# Altium project MAIN_BOARD.PrjPcb (part 2 of 3)

## Sheet USB.SchDoc
size C; SheetNumber: 5; SheetTotal: 9
Used 2 times, as channels USB0, USB1. Parts and nets are listed once, with the designators drawn on the sheet.
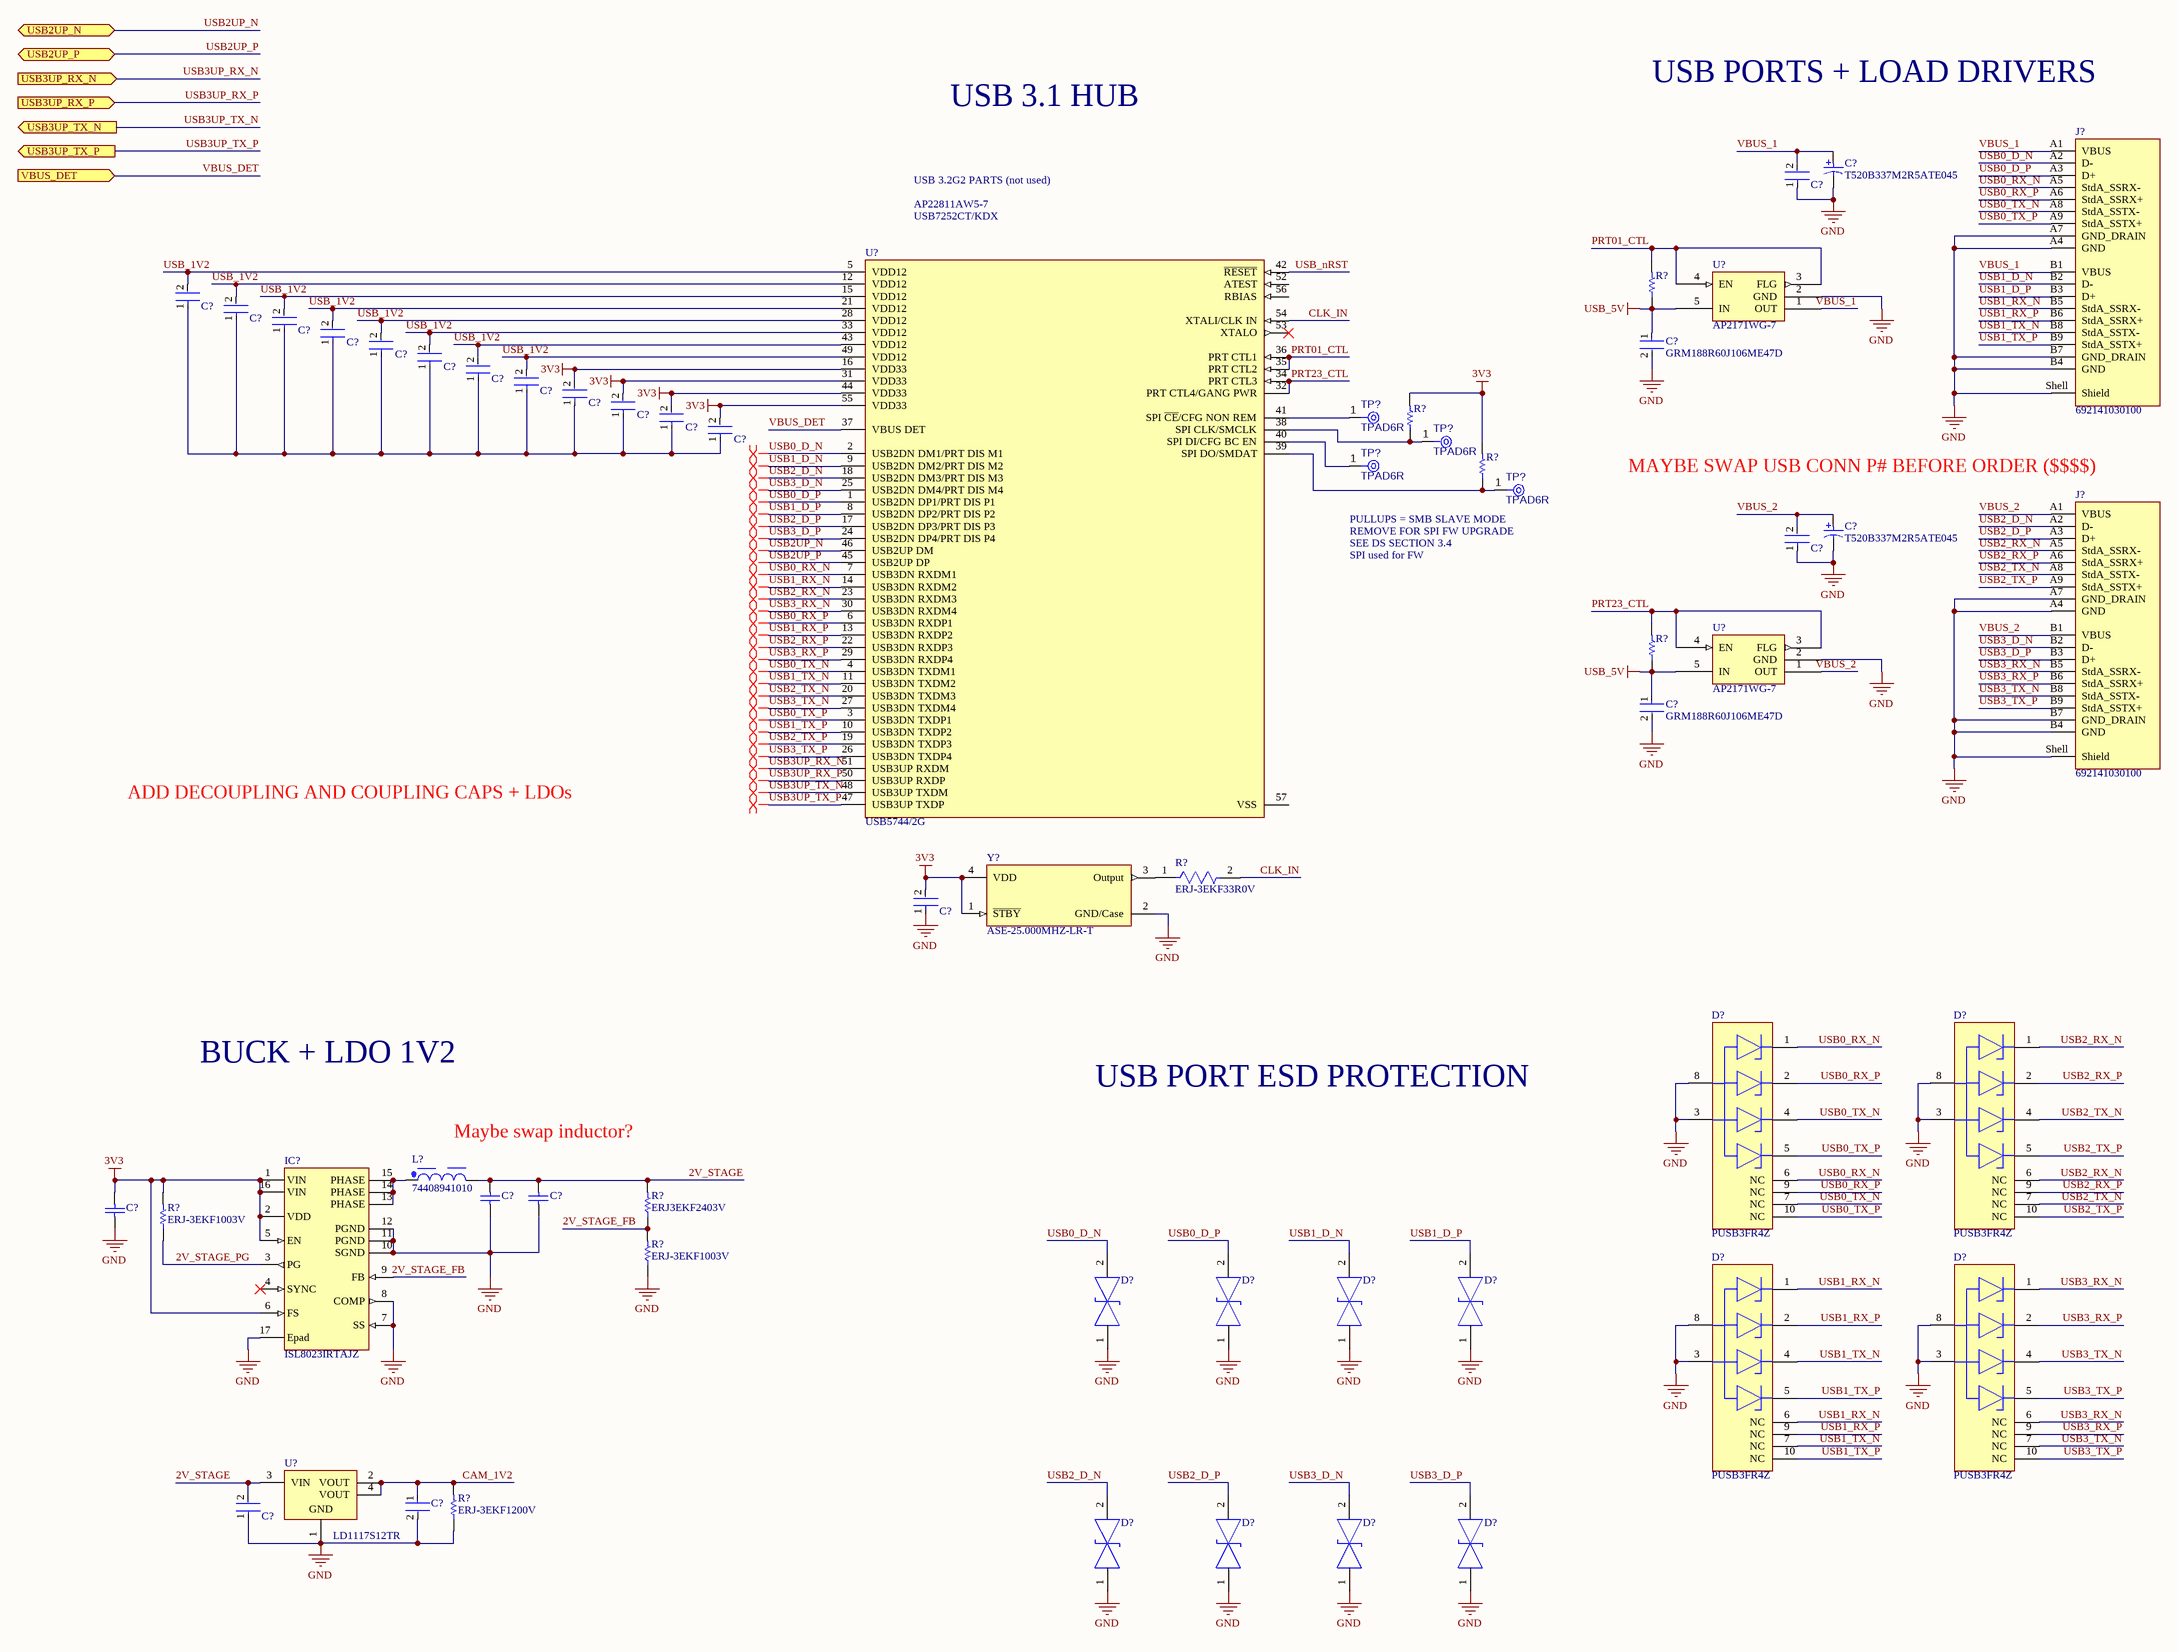
[diagram p7: USB.SchDoc]

### Parts
(Parts that share a designator on the sheet are numbered #1, #2 ... from top to bottom, then left to right.)
C?#1  T520B337M2R5ATE045  [KEMT-520-B-2_M]
C?#2  C1005X7R1H104K050BB  [FP-C1005-050-0_05-IPC_C]  (value not drawn)
C?#3  C1005X7R1H104K050BB  [FP-C1005-050-0_05-IPC_C]  (value not drawn)
C?#4  C1005X7R1H104K050BB  [FP-C1005-050-0_05-IPC_C]  (value not drawn)
C?#5  C1005X7R1H104K050BB  [FP-C1005-050-0_05-IPC_C]  (value not drawn)
C?#6  GRM188R60J106ME47D  [FP-GRM188-0_1-e0_2_0_55-IPC_A]
C?#7  C1005X7R1H104K050BB  [FP-C1005-050-0_05-IPC_C]  (value not drawn)
C?#8  C1005X7R1H104K050BB  [FP-C1005-050-0_05-IPC_C]  (value not drawn)
C?#9  C1005X7R1H104K050BB  [FP-C1005-050-0_05-IPC_C]  (value not drawn)
C?#10  C1005X7R1H104K050BB  [FP-C1005-050-0_05-IPC_C]  (value not drawn)
C?#11  C1005X7R1H104K050BB  [FP-C1005-050-0_05-IPC_C]  (value not drawn)
C?#12  C1005X7R1H104K050BB  [FP-C1005-050-0_05-IPC_C]  (value not drawn)
C?#13  C1005X7R1H104K050BB  [FP-C1005-050-0_05-IPC_C]  (value not drawn)
C?#14  C1005X7R1H104K050BB  [FP-C1005-050-0_05-IPC_C]  (value not drawn)
C?#15  C1005X7R1H104K050BB  [FP-C1005-050-0_05-IPC_C]  (value not drawn)
C?#16  T520B337M2R5ATE045  [KEMT-520-B-2_M]
C?#17  C1005X7R1H104K050BB  [FP-C1005-050-0_05-IPC_C]  (value not drawn)
C?#18  GRM188R60J106ME47D  [FP-GRM188-0_1-e0_2_0_55-IPC_A]
C?#19  C1005X7R1H104K050BB  [FP-C1005-050-0_05-IPC_C]  (value not drawn)
C?#20  C1608X5R0J226M080AC  [CAPC1608X100X20ML10]  (value not drawn)
C?#21  C1608X5R0J226M080AC  [CAPC1608X100X20ML10]  (value not drawn)
C?#22  C1608X5R0J226M080AC  [CAPC1608X100X20ML10]  (value not drawn)
C?#23  GRM188R60J106ME47D  [FP-GRM188-0_1-e0_2_0_55-IPC_A]  (value not drawn)
C?#24  C1005X7R1H104K050BB  [FP-C1005-050-0_05-IPC_C]  (value not drawn)
D?#1  PUSB3FR4Z  [FP-SOT1176-1-MFG]
D?#2  PUSB3FR4Z  [FP-SOT1176-1-MFG]
D?#3  PUSB3FR4Z  [FP-SOT1176-1-MFG]
D?#4  PUSB3FR4Z  [FP-SOT1176-1-MFG]
D?#5  ESD231B1W0201E6327XTSA1  [FP-SG-WLL-2-MFG]  (value not drawn)
D?#6  ESD231B1W0201E6327XTSA1  [FP-SG-WLL-2-MFG]  (value not drawn)
D?#7  ESD231B1W0201E6327XTSA1  [FP-SG-WLL-2-MFG]  (value not drawn)
D?#8  ESD231B1W0201E6327XTSA1  [FP-SG-WLL-2-MFG]  (value not drawn)
D?#9  ESD231B1W0201E6327XTSA1  [FP-SG-WLL-2-MFG]  (value not drawn)
D?#10  ESD231B1W0201E6327XTSA1  [FP-SG-WLL-2-MFG]  (value not drawn)
D?#11  ESD231B1W0201E6327XTSA1  [FP-SG-WLL-2-MFG]  (value not drawn)
D?#12  ESD231B1W0201E6327XTSA1  [FP-SG-WLL-2-MFG]  (value not drawn)
IC?  ISL8023IRTAJZ  [TQFN50P300X300X80_HS-17N]
J?#1  692141030100  [692141030100]
J?#2  692141030100  [692141030100]
L?  74408941010  [WE-SPC_4818]
R?#1  ERJ3EKF1002V  [RESC1609X55X30LL15T15]  (value not drawn)
R?#2  ERJ3EKF1002V  [RESC1609X55X30LL15T15]  (value not drawn)
R?#3  ERJ3EKF1002V  [RESC1609X55X30LL15T15]  (value not drawn)
R?#4  ERJ3EKF1002V  [RESC1609X55X30LL15T15]  (value not drawn)
R?#5  ERJ-3EKF33R0V  [FP-ERJ3EK-MFG]
R?#6  ERJ3EKF2403V  [RESC1608X55X30NL15T15]
R?#7  ERJ-3EKF1003V  [RESC1608X55X30ML15T15]
R?#8  ERJ-3EKF1003V  [RESC1608X55X30ML15T15]
R?#9  ERJ-3EKF1200V  [RESC1609X55X30ML15T15]
TP?#1  TPAD6R  [TP06R]  (no BOM)
TP?#2  TPAD6R  [TP06R]  (no BOM)
TP?#3  TPAD6R  [TP06R]  (no BOM)
TP?#4  TPAD6R  [TP06R]  (no BOM)
U?#1  USB5744/2G  [FP-USB5744-2G-MFG]
U?#2  AP2171WG-7  [SOT95P285X130-5N]
U?#3  AP2171WG-7  [SOT95P285X130-5N]
U?#4  LD1117S12TR  [SOT-223_M]
Y?  ASE-25.000MHZ-LR-T  [FP-ASE-MFG]

### Ports
USB2UP_N (bidir), USB2UP_P (bidir), USB3UP_RX_N (in), USB3UP_RX_P (in), USB3UP_TX_N (out), USB3UP_TX_P (out), VBUS_DET (in)

### Nets
3V3: C?#12.2 C?#13.2 C?#14.2 C?#15.2 C?#19.2 C?#22.2 IC?.1(VIN) IC?.2(VDD) IC?.5(EN) IC?.6(FS) IC?.16(VIN) R?#2.2 R?#3.2 R?#7.2 U?#1.16(VDD33) U?#1.31(VDD33) U?#1.44(VDD33) U?#1.55(VDD33) Y?.1(~{STBY}) Y?.4(VDD)
GND: C?#1.2 C?#2.1 C?#6.2 C?#16.2 C?#17.1 C?#18.2 C?#19.1 C?#20.1 C?#21.1 C?#22.1 C?#23.2 C?#24.1 D?#1.3(GND) D?#1.8(GND) D?#2.3(GND) D?#2.8(GND) D?#3.3(GND) D?#3.8(GND) D?#4.3(GND) D?#4.8(GND) D?#5.1 D?#6.1 D?#7.1 D?#8.1 D?#9.1 D?#10.1 D?#11.1 D?#12.1 IC?.7(SS) IC?.8(COMP) IC?.10(SGND) IC?.11(PGND) IC?.12(PGND) IC?.17(Epad) J?#1.A4(GND) J?#1.A7(GND_DRAIN) J?#1.B4(GND) J?#1.B7(GND_DRAIN) J?#1.Shell(Shield) J?#2.A4(GND) J?#2.A7(GND_DRAIN) J?#2.B4(GND) J?#2.B7(GND_DRAIN) J?#2.Shell(Shield) R?#8.1 R?#9.1 U?#2.2(GND) U?#3.2(GND) U?#4.1(GND) Y?.2(GND/Case)
USB_5V: C?#6.1 C?#18.1 R?#1.1 R?#4.1 U?#2.5(IN) U?#3.5(IN)
2V_STAGE: C?#20.2 C?#21.2 C?#24.2 L?.2 R?#6.2 U?#4.3(VIN)
2V_STAGE_FB: IC?.9(FB) R?#6.1 R?#8.2
2V_STAGE_PG: IC?.3(PG) R?#7.1
CAM_1V2: C?#23.1 R?#9.2 U?#4.2(VOUT) U?#4.4(VOUT)
CLK_IN: R?#5.2 U?#1.54(XTALI/CLK_IN)
PRT01_CTL: R?#1.2 U?#1.35(PRT_CTL2) U?#1.36(PRT_CTL1) U?#2.3(FLG) U?#2.4(EN)
PRT23_CTL: R?#4.2 U?#1.32(PRT_CTL4/GANG_PWR) U?#1.34(PRT_CTL3) U?#3.3(FLG) U?#3.4(EN)
USB0_D_N: D?#5.2 J?#1.A2(D-) U?#1.2(USB2DN_DM1/PRT_DIS_M1)
USB0_D_P: D?#6.2 J?#1.A3(D+) U?#1.1(USB2DN_DP1/PRT_DIS_P1)
USB0_RX_N: D?#1.1(CH1) D?#1.6(NC) J?#1.A5(StdA_SSRX-) U?#1.7(USB3DN_RXDM1)
USB0_RX_P: D?#1.2(CH2) D?#1.9(NC) J?#1.A6(StdA_SSRX+) U?#1.6(USB3DN_RXDP1)
USB0_TX_N: D?#1.4(CH3) D?#1.7(NC) J?#1.A8(StdA_SSTX-) U?#1.4(USB3DN_TXDM1)
USB0_TX_P: D?#1.5(CH4) D?#1.10(NC) J?#1.A9(StdA_SSTX+) U?#1.3(USB3DN_TXDP1)
USB1_D_N: D?#7.2 J?#1.B2(D-) U?#1.9(USB2DN_DM2/PRT_DIS_M2)
USB1_D_P: D?#8.2 J?#1.B3(D+) U?#1.8(USB2DN_DP2/PRT_DIS_P2)
USB1_RX_N: D?#3.1(CH1) D?#3.6(NC) J?#1.B5(StdA_SSRX-) U?#1.14(USB3DN_RXDM2)
USB1_RX_P: D?#3.2(CH2) D?#3.9(NC) J?#1.B6(StdA_SSRX+) U?#1.13(USB3DN_RXDP2)
USB1_TX_N: D?#3.4(CH3) D?#3.7(NC) J?#1.B8(StdA_SSTX-) U?#1.11(USB3DN_TXDM2)
USB1_TX_P: D?#3.5(CH4) D?#3.10(NC) J?#1.B9(StdA_SSTX+) U?#1.10(USB3DN_TXDP2)
USB2_D_N: D?#9.2 J?#2.A2(D-) U?#1.18(USB2DN_DM3/PRT_DIS_M3)
USB2_D_P: D?#10.2 J?#2.A3(D+) U?#1.17(USB2DN_DP3/PRT_DIS_P3)
USB2_RX_N: D?#2.1(CH1) D?#2.6(NC) J?#2.A5(StdA_SSRX-) U?#1.23(USB3DN_RXDM3)
USB2_RX_P: D?#2.2(CH2) D?#2.9(NC) J?#2.A6(StdA_SSRX+) U?#1.22(USB3DN_RXDP3)
USB2_TX_N: D?#2.4(CH3) D?#2.7(NC) J?#2.A8(StdA_SSTX-) U?#1.20(USB3DN_TXDM3)
USB2_TX_P: D?#2.5(CH4) D?#2.10(NC) J?#2.A9(StdA_SSTX+) U?#1.19(USB3DN_TXDP3)
USB2UP_N: U?#1.46(USB2UP_DM) ; port USB2UP_N
USB2UP_P: U?#1.45(USB2UP_DP) ; port USB2UP_P
USB3_D_N: D?#11.2 J?#2.B2(D-) U?#1.25(USB2DN_DM4/PRT_DIS_M4)
USB3_D_P: D?#12.2 J?#2.B3(D+) U?#1.24(USB2DN_DP4/PRT_DIS_P4)
USB3_RX_N: D?#4.1(CH1) D?#4.6(NC) J?#2.B5(StdA_SSRX-) U?#1.30(USB3DN_RXDM4)
USB3_RX_P: D?#4.2(CH2) D?#4.9(NC) J?#2.B6(StdA_SSRX+) U?#1.29(USB3DN_RXDP4)
USB3_TX_N: D?#4.4(CH3) D?#4.7(NC) J?#2.B8(StdA_SSTX-) U?#1.27(USB3DN_TXDM4)
USB3_TX_P: D?#4.5(CH4) D?#4.10(NC) J?#2.B9(StdA_SSTX+) U?#1.26(USB3DN_TXDP4)
USB3UP_RX_N: U?#1.51(USB3UP_RXDM) ; port USB3UP_RX_N
USB3UP_RX_P: U?#1.50(USB3UP_RXDP) ; port USB3UP_RX_P
USB3UP_TX_N: U?#1.48(USB3UP_TXDM) ; port USB3UP_TX_N
USB3UP_TX_P: U?#1.47(USB3UP_TXDP) ; port USB3UP_TX_P
USB_1V2: C?#3.2 C?#4.2 C?#5.2 C?#7.2 C?#8.2 C?#9.2 C?#10.2 C?#11.2 U?#1.5(VDD12) U?#1.12(VDD12) U?#1.15(VDD12) U?#1.21(VDD12) U?#1.28(VDD12) U?#1.33(VDD12) U?#1.43(VDD12) U?#1.49(VDD12)
USB_nRST: U?#1.42(~{RESET})
VBUS_1: C?#1.1 C?#2.2 J?#1.A1(VBUS) J?#1.B1(VBUS) U?#2.1(OUT)
VBUS_2: C?#16.1 C?#17.2 J?#2.A1(VBUS) J?#2.B1(VBUS) U?#3.1(OUT)
VBUS_DET: U?#1.37(VBUS_DET) ; port VBUS_DET
NetC?#3_1: C?#3.1 C?#4.1 C?#5.1 C?#7.1 C?#8.1 C?#9.1 C?#10.1 C?#11.1 C?#12.1 C?#13.1 C?#14.1 C?#15.1
NetIC?_13: IC?.13(PHASE) IC?.14(PHASE) IC?.15(PHASE) L?.1
NetR?#2_1: R?#2.1 TP?#2.1(TP) U?#1.38(SPI_CLK/SMCLK)
NetR?#3_1: R?#3.1 TP?#4.1(TP) U?#1.39(SPI_DO/SMDAT)
NetR?#5_1: R?#5.1 Y?.3(Output)
NetTP?#1_1: TP?#1.1(TP) U?#1.41(SPI_~{CE}/CFG_NON_REM)
NetTP?#3_1: TP?#3.1(TP) U?#1.40(SPI_DI/CFG_BC_EN)

Not connected (* = marked no-connect by the designer): IC? 4(SYNC)*; U?#1 52(ATEST) 53(XTALO)* 56(RBIAS) 57(VSS)

### Channels
USB0: designators C?=C?_USB0#19 C?=C?_USB0#1 C?=C?_USB0#16 C?=C?_USB0#2 C?=C?_USB0#17 C?=C?_USB0#6 C?=C?_USB0#18 C?=C?_USB0#15 C?=C?_USB0#14 C?=C?_USB0#13 C?=C?_USB0#12 C?=C?_USB0#11 C?=C?_USB0#10 C?=C?_USB0#9 C?=C?_USB0#8 C?=C?_USB0#7 C?=C?_USB0#5 C?=C?_USB0#4 C?=C?_USB0#3 C?=C?_USB0#24 C?=C?_USB0#23 C?=C?_USB0#22 C?=C?_USB0#21 C?=C?_USB0#20 D?=D?_USB0#3 D?=D?_USB0#4 D?=D?_USB0#2 D?=D?_USB0#1 D?=D?_USB0#5 D?=D?_USB0#6 D?=D?_USB0#7 D?=D?_USB0#8 D?=D?_USB0#9 D?=D?_USB0#10 D?=D?_USB0#11 D?=D?_USB0#12 IC?=IC?_USB0 J?=J?_USB0#1 J?=J?_USB0#2 L?=L?_USB0 R?=R?_USB0#5 R?=R?_USB0#2 R?=R?_USB0#3 R?=R?_USB0#1 R?=R?_USB0#4 R?=R?_USB0#9 R?=R?_USB0#7 R?=R?_USB0#6 R?=R?_USB0#8 TP?=TP?_USB0#1 TP?=TP?_USB0#2 TP?=TP?_USB0#3 TP?=TP?_USB0#4 U?=U?_USB0#1 U?=U?_USB0#2 U?=U?_USB0#3 U?=U?_USB0#4 Y?=Y?_USB0; ports USB2UP_N=USB2UP_N_USB0 USB2UP_P=USB2UP_P_USB0 USB3UP_RX_N=USB3UP_RX_N_USB0 USB3UP_RX_P=USB3UP_RX_P_USB0 USB3UP_TX_N=USB3UP_TX_N_USB0 USB3UP_TX_P=USB3UP_TX_P_USB0 VBUS_DET=VBUS_DET_USB0
USB1: designators C?=C?_USB1#19 C?=C?_USB1#1 C?=C?_USB1#16 C?=C?_USB1#2 C?=C?_USB1#17 C?=C?_USB1#6 C?=C?_USB1#18 C?=C?_USB1#15 C?=C?_USB1#14 C?=C?_USB1#13 C?=C?_USB1#12 C?=C?_USB1#11 C?=C?_USB1#10 C?=C?_USB1#9 C?=C?_USB1#8 C?=C?_USB1#7 C?=C?_USB1#5 C?=C?_USB1#4 C?=C?_USB1#3 C?=C?_USB1#24 C?=C?_USB1#23 C?=C?_USB1#22 C?=C?_USB1#21 C?=C?_USB1#20 D?=D?_USB1#3 D?=D?_USB1#4 D?=D?_USB1#2 D?=D?_USB1#1 D?=D?_USB1#5 D?=D?_USB1#6 D?=D?_USB1#7 D?=D?_USB1#8 D?=D?_USB1#9 D?=D?_USB1#10 D?=D?_USB1#11 D?=D?_USB1#12 IC?=IC?_USB1 J?=J?_USB1#1 J?=J?_USB1#2 L?=L?_USB1 R?=R?_USB1#5 R?=R?_USB1#2 R?=R?_USB1#3 R?=R?_USB1#1 R?=R?_USB1#4 R?=R?_USB1#9 R?=R?_USB1#7 R?=R?_USB1#6 R?=R?_USB1#8 TP?=TP?_USB1#1 TP?=TP?_USB1#2 TP?=TP?_USB1#3 TP?=TP?_USB1#4 U?=U?_USB1#1 U?=U?_USB1#2 U?=U?_USB1#3 U?=U?_USB1#4 Y?=Y?_USB1; ports USB2UP_N=USB2UP_N_USB1 USB2UP_P=USB2UP_P_USB1 USB3UP_RX_N=USB3UP_RX_N_USB1 USB3UP_RX_P=USB3UP_RX_P_USB1 USB3UP_TX_N=USB3UP_TX_N_USB1 USB3UP_TX_P=USB3UP_TX_P_USB1 VBUS_DET=VBUS_DET_USB1

### Layout directives
differential pair: USB0_D_N_USB0, USB0_D_P_USB0, USB0_RX_N_USB0, USB0_RX_P_USB0, USB0_TX_N_USB0, USB0_TX_P_USB0, USB1_D_N_USB0, USB1_D_P_USB0, USB1_RX_N_USB0, USB1_RX_P_USB0, USB1_TX_N_USB0, USB1_TX_P_USB0, USB2_D_N_USB0, USB2_D_P_USB0, USB2_RX_N_USB0, USB2_RX_P_USB0, USB2_TX_N_USB0, USB2_TX_P_USB0, USB2UP_N_USB0, USB2UP_P_USB0, USB3_D_N_USB0, USB3_D_P_USB0, USB3_RX_N_USB0, USB3_RX_P_USB0, USB3_TX_N_USB0, USB3_TX_P_USB0, USB3UP_RX_N_USB0, USB3UP_RX_P_USB0, USB3UP_TX_N_USB0, USB3UP_TX_P_USB0

### Notes on the sheet
- USB 3.1 HUB
- USB PORTS + LOAD DRIVERS
- AP22811AW5-7
- USB7252CT/KDX
- USB 3.2G2 PARTS (not used)
- MAYBE SWAP USB CONN P# BEFORE ORDER ($$$$)
- PULLUPS = SMB SLAVE MODE
- REMOVE FOR SPI FW UPGRADE
- SPI used for FW
- SEE DS SECTION 3.4
- ADD DECOUPLING AND COUPLING CAPS + LDOs
- BUCK + LDO 1V2
- Maybe swap inductor?
- USB PORT ESD PROTECTION

### Library data of the parts
C?#1 C?#16 = CMP-1664-00002-2: Tantalum Capacitor, 330 uF, +/- 20%, 2.5 V, -55 to 105 degC, 2-Pin Molded, RoHS, Tape and Reel; Capacitance: 330 uF; PartNumber: T520B337M2R5ATE045; DatasheetVersion: 07/2016; Radiation Hardening: No; ComponentLink2Description: Datasheet; PackageDescription: 2-Pin Surface Mount Device, Body 3.5 x 2.8 mm; Width: 2.8 mm; ComponentLink2URL: http://capacitoredge.kemet.com/capedge2/DataSheet?pn=T520B337M2R5ATE045; Case/Package: 1411; Length: 3.5 mm; Package Quantity: 2000; Max Operating Temperature: 105 degC; Mounting Technology: Surface Mount; Height: 2.1 mm; RoHSCompliant: True; ComponentLink1URL: http://www.kemet.com/; Mount: Surface Mount; Packaging: Tape and Reel; ComponentLink1Description: Manufacturer URL; Min Operating Temperature: -55 degC
C?#2-C?#5 C?#7-C?#15 C?#17 C?#19 C?#24 = CMP-2000-05393-2: as C?#1 on sheet CAMERA_INTERFACE; Voltage: 50V; Dielectric Material: Ceramic; Min Operating Temperature: -55°C; Depth: 0.5mm; Radiation Hardening: No; RoHS Compliant: Yes; Voltage Rating (DC): 50V; Lead Free: Lead Free; Resistor Type: Ceramic; Height: 0.5mm; Dielectric: X7R; Thickness: 0.022inch; Case/Package: 0402; Case Code (Metric): 1005; Termination: SMD/SMT; Capacitance: 100nF; Packaging: Tape and Reel; Max Operating Temperature: 125°C; Mount: Surface Mount; Package Quantity: 1; Width: 0.02inch; Weight: 2.3E-05oz; Voltage Rating: 50V; Tolerance: 10%; Construction: Flat; Case Code (Imperial): 0402; Length: 1mm; REACH SVHC: No SVHC; Series: C
C?#6 C?#18 C?#23 = CMP-2006-02792-2: as C?#21 on sheet CAMERA_INTERFACE; Packaging: Tape and Reel; Voltage Rating (DC): 6.3V; Width: 0.031inch; Termination: SMD/SMT; Dielectric: X5R; Package Quantity: 4000; Voltage Rating: 6.3V; Capacitance: 10uF; Case/Package: 0603; Min Operating Temperature: -55°C; Voltage: 6.3V; Length: 1.6mm; Thickness: 0.035inch; Lead Free: Lead Free; Depth: 0.8mm; Case Code (Imperial): 0603; Max Operating Temperature: 85°C; Material: Ceramic; Height: 0.8mm; Tolerance: 20%; Mount: Surface Mount; REACH SVHC: No SVHC; Radiation Hardening: No; Case Code (Metric): 1608
C?#20-C?#22 = CMP-2000-05440-1: Chip Capacitor, 22 uF, +/- 20%, 6.3 V, -55 to 85 degC, 1608 (0603 Metric), RoHS, Tape and Reel; PCN Part Number: MLCCPartNumberChange30/Nov/2012; Manufacturer: TDK; Temperature Coefficient: X5R; Product Training Modules: CSeriesGeneralApplicationsSEAT,CCV,andTVCLDesignToolsGuidetoReplacinganElectrolyticCapacitorwithanMLCC; Other Names: 445-8028-1; Capacitance: 22µF; Voltage - Rated: 6.3V; Design Resources: 20WNon-IsolatedBuckLEDDriverUsingPLLNK460KG; Online Catalog: CSeries,GeneralPurpose; Kits: 445-9003-KIT-ND-KITCAPCERHICAPMLCCSMD; Tolerance: ±20%; Series: C; Thickness (Max): 0.039"(1.00mm); Mounting Type: SurfaceMount,MLCC; Ratings: -; Datasheet Version: Mar-15; Package Reference: 603; Packaging: CutTape(CT); Features: -; Package / Case: 0603(1608Metric); Family: CeramicCapacitors; Lead Spacing: -; RoHS Information: RoHSCertificate-MLCC; Manufacturer URL: http://www.tdk.com/; Lead Style: -; Category: Capacitors; Applications: GeneralPurpose; Package Description: 2-Pin Surface Mount Device, Body 1.6 x 0.8 mm; Standard Package: 1; Datasheet URL: http://www.farnell.com/datasheets/1913358.pdf; Height - Seated (Max): -; Operating Temperature: -55degC~85degC; Size / Dimension: 0.063"Lx0.031"W(1.60mmx0.80mm)
D?#1-D?#4 = CMP-14432-000005-1: TVS DIODE 3.3VWM 3VC DFN2510A-10; RoHS Compliant: Yes
D?#5-D?#12 = CMP-32928-000003-1: TVS DIODE 5.5V 10V WLL-2-1; Manufacturer: Infineon; Number Of Channels: 1; Value: 3.5pF; Direction: Bidirectional; Peak Pulse Power: 132W; Peak Pulse Current: 12A; Temperature Range Low: -55°C; Automotive: No; Clamping Voltage: 10V; ComponentLink2Description: Datasheet; Lead Free: Yes; Octopart: https://octopart.com/esd231b1w0201e6327xtsa1-infineon-73507963; Mouser Description: 5.5V, 3.5pF, 0201, Bi-directional ESD/TVS Diode; Package: SG-WLL-2; Device Class L3: unset; Reverse Standoff Voltage: 5.5V; ComponentLink2URL: https://www.infineon.com/dgdl/Infineon-ESD231-B1-W0201-DS-v01_02-EN.pdf?fileId=5546d462503812bb0150854d4bac4c9d; Category: Diode; Device Class L2: TVS Diodes; Temperature Range High: +125°C; Manufacturer Part Number: ESD231B1W0201E6327XTSA1; Digikey Description: TVS DIODE 5.5V 10V WLL-2-1; Device Class L1: Circuit Protection; Temperature: -55°C to +125°C; Capacitance: 3.5pF; Footprint Url: https://www.infineon.com/cms/en/product/packages/SG-WLL/SG-WLL-2-1/; Height: 0.16mm; RoHS: TRUE
IC? = CMP-00572-88252977-1: ISL8023IRTAJZ Conv DC-DC Single Step Down 2.7V to 5.5V 16-Pin QFN EP; Output Current: 3A; NexarPartId: 88252977; Output Voltage: 5.5V
J?#1 J?#2 = CMP-1502-03222-3: NexarPartId: 19667819; Connector Type: USB; Contact Resistance: 50mΩ; USB Standard: USB 3.0; Insulation Resistance: 100MΩ; Number of Contacts: 18; Gender: Receptacle; Number of Ports: 2; Voltage Rating (AC): 30V; Current Rating: 1.8A; Min Operating Temperature: -40°C; Max Operating Temperature: 85°C; Lead Free: Lead Free; Features: Shielded; Width: 19.7mm; Length: 15.59mm; Flammability Rating: UL94 V-0; Contact Plating: Gold; RoHS: Compliant; Number of Pins: 18; Termination: Through Hole; Contact Material: Bronze, Gold, Nickel; Mount: Horizontal, Through Hole; Voltage Rating: 30V; Operating Supply Voltage: 30V; REACH SVHC: Unknown; Orientation: Right Angle; Color: Blue; Height: 16.335mm
L? = CMP-1401-00006-2: NexarPartId: 23392449; Current Rating: 3A; DC Resistance (DCR): 25mΩ; Inductance: 1µH; Core Material: Ferrite; Self Resonant Frequency: 100MHz; Inductance Tolerance: 20%; Number of Pins: 2; Length: 4.8mm; Width: 4.8mm; Min Operating Temperature: -40°C; Packaging: Tape & Reel (TR); RoHS: Compliant; Height: 1.8mm; Ambient Temperature Range High: 85°C; Max Operating Temperature: 125°C; Ambient Temperature Range Low: -40°C
R?#1-R?#4 = CMP-1012-00623-3: as R?#4 on sheet CAMERA_INTERFACE; Number of Pins: 2; Package Reference: 603; Depth: 0.8mm; Mount: SurfaceMount; Package Description: 2-Pin Surface Mount Device, Body 1.6 x 0.85 mm; Datasheet Version: 02/2017; Length: 1.6mm; Lead Free: LeadFree; Height: 0.45mm; Number of Terminations: 2; Max Power Dissipation: 100mW; Min Operating Temperature: -55degC; Datasheet URL: https://industrial.panasonic.com/cdbs/www-data/pdf/RDA0000/AOA0000C304.pdf; Termination: SMD/SMT; Case Code (Metric): 1608; Case Code (Imperial): 0603; Tolerance: 1%; Max Operating Temperature: 155degC; RoHSCompliant: true; Voltage Rating (DC): 75V; Radiation Hardening: No; Packaging: TapeandReel; Composition: ThickFilm; Mounting Technology: SurfaceMount; Manufacturer URL: http://www.panasonic.com/; Width: 0.031inch; REACH SVHC: NoSVHC; Contact Plating: Tin; Military Standard: Not; Package Quantity: 1
R?#5 = CMP-2000-00443-2: RES SMD 33 OHM 1% 1/10W 0603; Voltage Rating (DC): 75V; Power Rating: 100mW; Resistance: 33R; Temperature Coefficient: 100ppm/°C; Min Operating Temperature: -55°C; Packaging: Tape and Reel; Mount: Surface Mount; Lead Free: Lead Free; Voltage Rating: 75V; Features: Automotive AEC-Q200; Height: 0.022inch; Width: 0.031inch; Number of Pins: 2; Package Quantity: 1; Case Code (Metric): 1608; Max Power Dissipation: 100mW; Case Code (Imperial): 0603; Termination: SMD/SMT; Resistance Tolerance: 1%; Max Operating Temperature: 155°C; Tolerance: 1%; Length: 1.6mm; Case/Package: 0603; Military Standard: Not; RoHS Compliant: Yes; Series: ERJ; Size Code: 0603; Construction: Rectangular; Number of Terminations: 2; Radiation Hardening: No; Resistor Type: Thick Film; Contact Plating: Tin; Depth: 0.8mm; REACH SVHC: No SVHC
R?#6 = CMP-2000-00363-1: Manufacturer: Panasonic; Part Number: ERJ3EKF2403V
R?#7 R?#8 = CMP-2000-00182-1: Manufacturer: Panasonic; Part Number: ERJ-3EKF1003V
R?#9 = CMP-2000-00213-2: Chip Resistor, 120 Ohm, +/- 1%, 0.1 W, -55 to 155 degC, 0603 (1608 Metric), RoHS, Tape and Reel; Manufacturer: Panasonic; Power Rating: 100mW; Voltage Rating (DC): 75V; Resistance: 120Ohm; Temperature Coefficient: 100ppm/degreesC; Number of Terminations: 2; Military Standard: Not; Tolerance: 1%; Min Operating Temperature: -55degC; Packaging: TapeandReel; Lead Free: LeadFree; Max Operating Temperature: 155degC; Manufacturer URL: http://www.panasonic.com/; Case Code (Imperial): 0603; REACH SVHC: NoSVHC; Width: 0.031inch; Datasheet URL: https://industrial.panasonic.com/cdbs/www-data/pdf/RDA0000/AOA0000C283.pdf; RoHSCompliant: true; Max Power Dissipation: 100mW; Termination: SMD/SMT; Package Reference: 0603; Height: 0.022inch; Depth: 0.8mm; Package Description: 2-Pin Surface Mount Device, Body 1.6 x 0.85 mm; Contact Plating: Tin; Length: 1.6mm; Package URL: http://www.st.com/st-web-ui/static/active/en/resource/technical/document/datasheet/CD00001320.pdf; Radiation Hardening: No; Package Quantity: 1; Number of Pins: 2; Datasheet Version: 42095.0; Voltage Rating: 75V; Composition: ThickFilm; Case/Package: 0603; Mount: SurfaceMount; Case Code (Metric): 1608
TP?#1-TP?#4 = CMP-00028-00002-2: 0.6mm round; Pins: 1
U?#1 = CMP-06284-000017-1: IC HUB CTLR USB 56VQFN; Min Operating Temperature: 0°C; Packaging: Tray; Lead Free: Lead Free; Interface: USB; Max Operating Temperature: 70°C
U?#2 U?#3 = CMP-019-00057-1: IC PWR SW USB 1CH 1A SOT-25-5
U?#4 = CMP-0244-00318-1: Fixed Low Drop Positive Voltage Regulator, 1.2V, 4-Pin SOT-223, Tape and Reel; PackageDescription: 4-Pin SOT-223 Package, 6.5 x 3.5 mm Body, 2.3 mm Pitch, 7 mm Lead Span; PackageVersion: 2010; ComponentLink2Description: Datasheet; PackageReference: SOT-223; ComponentLink2URL: http://www.st.com/internet/com/TECHNICAL_RESOURCES/TECHNICAL_LITERATURE/DATASHEET/CD00000544.pdf; ComponentLink1Description: Manufacturer URL; DatasheetVersion: 1/11/2011; ComponentLink1URL: http://www.st.com
Y? = CMP-27762-000357-1: XTAL Oscillator 25MHz ±25ppm CMOS 3.3V 4-SMD 3.2mm x 2.5mm; Min Supply Voltage: 3.135V; Max Supply Current: 13mA; Max Supply Voltage: 3.465V; Load Capacitance: 15pF; Height: 0.047inch; Series: ASE; Frequency Stability: 25ppm; Mount: Surface Mount; Case/Package: SMD/SMT; Width: 0.098inch; Operating Frequency: 25 MHz; REACH SVHC: No SVHC; Package Quantity: 1000; Number of Pins: 4; Termination: SMD/SMT; Frequency: 25MHz; Max Operating Temperature: 85°C; Packaging: Tape and Reel; Min Operating Temperature: -40°C; Lead Free: Lead Free; Length: 0.126inch; Operating Supply Voltage: 3.3V

## Sheet ETHERNET.SchDoc
size A4; SheetNumber: 5; SheetTotal: 8
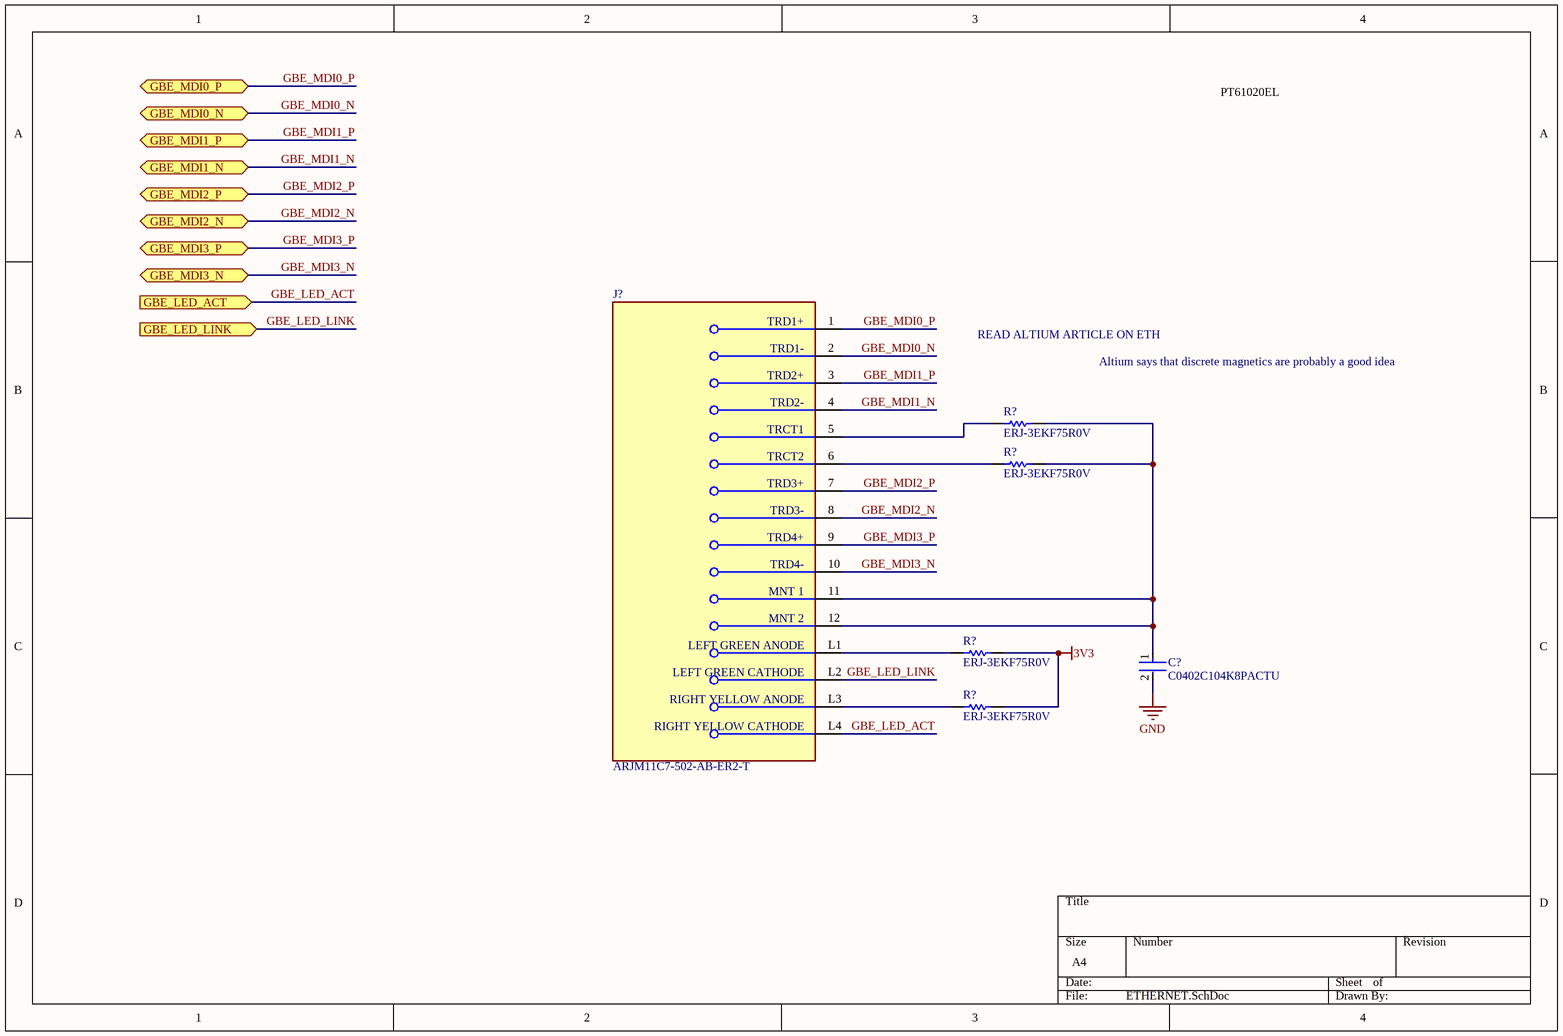
[diagram p8: ETHERNET.SchDoc]

### Parts
(Parts that share a designator on the sheet are numbered #1, #2 ... from top to bottom, then left to right.)
C?#1  C0402C104K8PACTU  [FP-C0402-BB-MFG]
J?#9  ARJM11C7-502-AB-ER2-T  [FP-ARJM11C7-502-AB-ER2-T-MFG]
R?#1  ERJ-3EKF75R0V  [RESC1608X55X30LL15T15]
R?#2  ERJ-3EKF75R0V  [RESC1608X55X30LL15T15]
R?#3  ERJ-3EKF75R0V  [RESC1608X55X30LL15T15]
R?#4  ERJ-3EKF75R0V  [RESC1608X55X30LL15T15]

### Ports
GBE_LED_ACT (in), GBE_LED_LINK (in), GBE_MDI0_N (bidir), GBE_MDI0_P (bidir), GBE_MDI1_N (bidir), GBE_MDI1_P (bidir), GBE_MDI2_N (bidir), GBE_MDI2_P (bidir), GBE_MDI3_N (bidir), GBE_MDI3_P (bidir)

### Nets
3V3: R?#3.1 R?#4.1
GND: C?#1.2
GBE_LED_ACT: J?#9.L4(RIGHT_YELLOW_CATHODE) ; port GBE_LED_ACT
GBE_LED_LINK: J?#9.L2(LEFT_GREEN_CATHODE) ; port GBE_LED_LINK
GBE_MDI0_N: J?#9.2(TRD1-) ; port GBE_MDI0_N
GBE_MDI0_P: J?#9.1(TRD1+) ; port GBE_MDI0_P
GBE_MDI1_N: J?#9.4(TRD2-) ; port GBE_MDI1_N
GBE_MDI1_P: J?#9.3(TRD2+) ; port GBE_MDI1_P
GBE_MDI2_N: J?#9.8(TRD3-) ; port GBE_MDI2_N
GBE_MDI2_P: J?#9.7(TRD3+) ; port GBE_MDI2_P
GBE_MDI3_N: J?#9.10(TRD4-) ; port GBE_MDI3_N
GBE_MDI3_P: J?#9.9(TRD4+) ; port GBE_MDI3_P
NetC?#1_1: C?#1.1 J?#9.11(MNT_1) J?#9.12(MNT_2) R?#1.1 R?#2.1
NetJ?#9_5: J?#9.5(TRCT1) R?#1.2
NetJ?#9_6: J?#9.6(TRCT2) R?#2.2
NetJ?#9_L1: J?#9.L1(LEFT_GREEN_ANODE) R?#3.2
NetJ?#9_L3: J?#9.L3(RIGHT_YELLOW_ANODE) R?#4.2

### Notes on the sheet
- PT61020EL
- READ ALTIUM ARTICLE ON ETH
- Altium says that discrete magnetics are probably a good idea

### Library data of the parts
C?#1 = CMP-2008-02046-2: CAP CER 0.1UF 10V X5R 0402; Manufacturer: Kemet; Material: Ceramic; Capacitance: 0.10 μF; Temperature Coefficient: 15%; Tolerance: 0.1; Value: 0.10 μF; Package: C0402-BB; Temperature: -55°C to +125°C; ComponentLink2Description: Datasheet; Temperature Characteristic: X5R; Device Class L1: Passive Components; Height: 0.55mm; Lead Free: Yes; ComponentLink2URL: https://content.kemet.com/datasheets/KEM_C1002_X7R_SMD.pdf; Device Class L2: Capacitors; Temperature Range Low: -55°C; Temperature Range High: +125°C; RoHS: TRUE; Octopart: https://octopart.com/c0402c104k8pactu-kemet-140039; Automotive: No; Mouser Description: Capacitor 100 nF 10 VDC 0402; Category: Cap; Voltage Rating: 10 V; Digikey Description: CAP CER 0.1UF 10V X5R 0402; Ipc Land Pattern Name: CAPC10050X50; Device Class L3: Ceramic Capacitors; Manufacturer Part Number: C0402C104K8PACTU
J?#9 = CMP-27893-000001-1: RJ45 JACK W/MAG 1X1 1000BASE-T; Manufacturer: Abracon; Conn Gender: Female; Is Female: yes; Shielding: true; Pitch: 1.27mm; Number Of Contacts: 10; Conn Orientation: Right Angle; RoHS: TRUE; Digikey Description: RJ45 JACK W/MAG 1X1 1000BASE-T; Temperature Range Low: -40°C; ComponentLink2Description: Datasheet; Category: Conn; Temperature Range High: +85°C; Package: 0; Device Class L1: Connectors; Manufacturer Part Number: ARJM11C7-502-AB-ER2-T; ComponentLink2URL: https://abracon.com/Magnetics/ARJM11.pdf; Automotive: No; Contact Material: Gold; Height: 15.8mm; Lead Free: Yes; Temperature: -40°C to +85°C; Device Class L2: Modular / Ethernet Connectors; Device Class L3: unset; Octopart: https://octopart.com/arjm11c7-502-ab-er2-t-abracon-86945316
R?#1-R?#4 = CMP-2000-00639-1: Manufacturer: Panasonic; Part Number: ERJ-3EKF75R0V

## Sheet REGULATORS.SchDoc
size A4; SheetNumber: 5; SheetTotal: 8
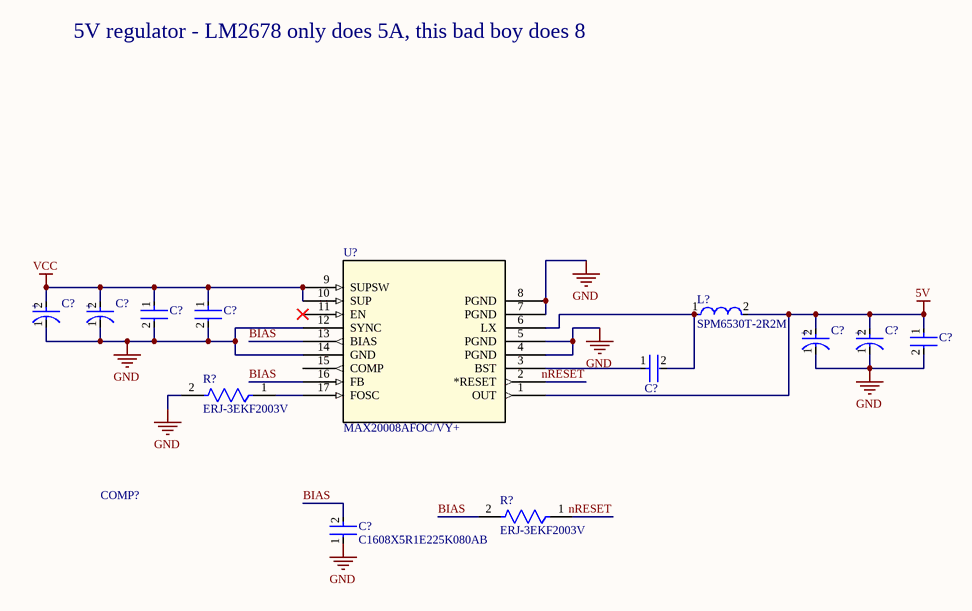
[diagram p9: REGULATORS.SchDoc]

### Parts
(Parts that share a designator on the sheet are numbered #1, #2 ... from top to bottom, then left to right.)
C?#2  100SXV6R8M  [FP-OS-CON-SMT-E7-MFG]  (value not drawn)
C?#3  100SXV6R8M  [FP-OS-CON-SMT-E7-MFG]  (value not drawn)
C?#4  C1206C475K4RACTU  [FP-C1206C475K4RACTU-MFG]  (value not drawn)
C?#5  C1005X7R1H104K050BB  [FP-C1005-050-0_05-IPC_C]  (value not drawn)
C?#6  EEHZA1H220P  [FP-EEH-D-MFG]  (value not drawn)
C?#7  EEHZA1H220P  [FP-EEH-D-MFG]  (value not drawn)
C?#8  C1206C475K4RACTU  [FP-C1206C475K4RACTU-MFG]  (value not drawn)
C?#9  C1005X7R1H104K050BB  [FP-C1005-050-0_05-IPC_C]  (value not drawn)
C?#10  C1608X5R1E225K080AB  [FP-C1608-080-0_1-MFG]
L?  SPM6530T-2R2M  [FP-SPM6530-MFG]
R?#5  ERJ-3EKF2003V  [FP-ERJ3EK-IPC_B]
R?#6  ERJ-3EKF2003V  [FP-ERJ3EK-IPC_B]
U?#1  MAX20008AFOC/VY+  [MAX20008AFOC_VY+-Footprint-1]

### Nets
5V: C?#6.2(A) C?#7.2(A) C?#8.1 L?.2 U?#1.1(OUT)
GND: C?#2.1(C) C?#3.1(C) C?#4.2 C?#5.2 C?#6.1(C) C?#7.1(C) C?#8.2 C?#10.1 R?#5.2 U?#1.4(PGND) U?#1.5(PGND) U?#1.7(PGND) U?#1.8(PGND) U?#1.12(SYNC) U?#1.14(GND)
VCC: C?#2.2(A) C?#3.2(A) C?#4.1 C?#5.1 U?#1.9(SUPSW) U?#1.10(SUP)
BIAS: C?#10.2 R?#6.2 U?#1.13(BIAS) U?#1.16(FB)
nRESET: R?#6.1 U?#1.2(*RESET)
NetC?#9_1: C?#9.1 U?#1.3(BST)
NetC?#9_2: C?#9.2 L?.1 U?#1.6(LX)
NetR?#5_1: R?#5.1 U?#1.17(FOSC)

Not connected (* = marked no-connect by the designer): U?#1 11(EN)* 15(COMP)

### Notes on the sheet
- 5V regulator - LM2678 only does 5A, this bad boy does 8
- COMP?
- (in symbol CMP-05428-001165-1) +
- (in symbol CMP-05428-001309-1) +

### Library data of the parts
C?#2 C?#3 = CMP-05428-001165-1: Conductive Polymer Aluminum Solid Capacitors (OS-CON) 6.8uF ±20% 100V RADIAL SMT 8x6.9mm; Life (Hours): 1000Hour; ESR (Equivalent Series Resistance): 60mR; Capacitance: 6.8uF; Case/Package: Radial; Max Operating Temperature: 125°C; Min Operating Temperature: -55°C; Tolerance: 20%; Mount: Surface Mount; Packaging: Cut Tape; Series: OS-CON™, SXV; Voltage Rating: 100V
C?#4 C?#8 = CMP-03020-034664-1: CAP CER 4.7UF 16V X7R 1206; Tolerance: 10%; Dielectric Material: Ceramic; Dissipation Factor: 5%; Voltage: 16V; Construction: Flat; Case Code (Imperial): 1206; REACH SVHC: No SVHC; Series: C; Length: 3.2mm; Max Operating Temperature: 125°C; Voltage Rating (DC): 16V; Mount: Surface Mount; Thickness: 0.071inch; Height: 1.2mm; Voltage Rating: 16V; Case/Package: 1206; Termination: SMD/SMT; Depth: 1.6mm; Dielectric: X7R; Width: 0.063inch; Min Operating Temperature: -55°C; Radiation Hardening: No; Case Code (Metric): 3216; RoHS Compliant: Yes; Capacitance: 4.7uF; Packaging: Tape and Reel; Package Quantity: 1; Number of Pins: 2
C?#5 C?#9 = CMP-2000-05393-2: as C?#1 on sheet CAMERA_INTERFACE; Voltage: 50V; Dielectric Material: Ceramic; Min Operating Temperature: -55°C; Depth: 0.5mm; Radiation Hardening: No; RoHS Compliant: Yes; Voltage Rating (DC): 50V; Lead Free: Lead Free; Resistor Type: Ceramic; Height: 0.5mm; Dielectric: X7R; Thickness: 0.022inch; Case/Package: 0402; Case Code (Metric): 1005; Termination: SMD/SMT; Capacitance: 100nF; Packaging: Tape and Reel; Max Operating Temperature: 125°C; Mount: Surface Mount; Package Quantity: 1; Width: 0.02inch; Weight: 2.3E-05oz; Voltage Rating: 50V; Tolerance: 10%; Construction: Flat; Case Code (Imperial): 0402; Length: 1mm; REACH SVHC: No SVHC; Series: C
C?#6 C?#7 = CMP-05428-001309-1: Aluminum Hybrid Polymer Capacitors 22uF 20% 50V Life 10000Hours AEC-Q200 RADIAL SMT; Ripple Current (AC): 1.1A; Lead Diameter: 0.65mm; Life (Hours): 5000Hour; ESR (Equivalent Series Resistance): 80mR; Leakage Current: 100uA; Technology: HYBRID; Height - Seated (Max): 0.24inch; Voltage Rating (DC): 50V; Min Operating Temperature: -55°C; Voltage Rating: 50V; Length: 5.8mm; Tolerance: 20%; Lead Pitch: 1.8mm; Voltage: 50V; Packaging: Tape and Reel; Mount: Surface Mount; REACH SVHC: No SVHC; Ripple Current: 1.1A; Case/Package: Radial; Package Quantity: 1000; Capacitance: 22uF; Series: ZA; Construction: Cylindrical; Diameter: 6.3mm; Height: 5.8mm; Max Operating Temperature: 105°C; Lead Free: Lead Free; RoHS Compliant: Yes; Termination: SMD/SMT; Material: Polymer; Radiation Hardening: No; Ratings: AEC-Q200
C?#10 = CMP-08246-003049-1: Multilayer Ceramic Capacitors 2.2μF ±10% 25V X5R SMD 0603; Capacitance: 2.2uF; Termination: SMD/SMT; Dielectric Material: Ceramic; REACH SVHC: No SVHC; Voltage Rating (DC): 25V; Voltage Rating: 25V; RoHS Compliant: Yes; Case Code (Imperial): 0603; Case/Package: 0603; Height: 0.8mm; Mount: Surface Mount; Min Operating Temperature: -55°C; Tolerance: 10%; Radiation Hardening: No; Dielectric: X5R; Depth: 0.8mm; Package Quantity: 4000; Length: 1.6mm; Weight: 7.1E-05oz; Resistor Type: Ceramic; Series: C; Thickness: 0.035inch; Width: 0.031inch; Case Code (Metric): 1608; Lead Free: Lead Free; Max Operating Temperature: 85°C; Packaging: Tape and Reel
L? = CMP-08253-000021-1: FIXED IND 2.2UH 8.2A 19 MOHM SMD; Manufacturer: TDK; Test Frequency: 100kHz; Shielding: true; Standoff Height: 0.15mm; Core Material: Metal; Saturation Current: 8.4A; Tolerance: 20%; Series Resistance: 19.1mΩ; Automotive: No; Octopart: https://octopart.com/spm6530t-2r2m-tdk-18903909; Mouser Description: Fixed Inductors 2.2uH 0.0173ohms 7.1x6.5x3mm; ComponentLink2URL: https://product.tdk.com/info/en/catalog/datasheets/inductor_commercial_power_spm6530_en.pdf; Height: 3mm; Device Class L2: Inductors; Package: SPM6530; Rms Current: 8.2A; ComponentLink2Description: Datasheet; RoHS: TRUE; Temperature Range Low: -40°C; Digikey Description: FIXED IND 2.2UH 8.2A 19 MOHM SMD; Device Class L1: Passive Components; Device Class L3: Fixed Inductors; Value: 2.2uH; Temperature Range High: +125°C; Inductance: 2.2uH; Temperature: -40°C to +125°C; Lead Free: Yes; Manufacturer Part Number: SPM6530T-2R2M; Composition: Wirewound; Category: Ind
R?#5 R?#6 = CMP-2000-00319-2: RES SMD 200K OHM 1% 1/10W 0603; Resistance: 200kR; Max Power Dissipation: 100mW; Working Voltage: 75V; Voltage Rating (DC): 50V; Temperature Coefficient: 100ppm/°C; Min Operating Temperature: -55°C; Resistor Type: Thick Film; Max Operating Temperature: 155°C; Packaging: Cut Tape; RoHS Compliant: Yes; Military Standard: Not; Termination: SMD/SMT; Tolerance: 1%; Case Code (Imperial): 0603; Depth: 0.8mm; Lead Free: Lead Free; Resistance Tolerance: 1%; Case Code (Metric): 1608; Mount: Surface Mount; Construction: Rectangular; REACH SVHC: No SVHC; Height: 0.022inch; Radiation Hardening: No; Package Quantity: 1; Voltage Rating: 75V; Contact Plating: Tin; Number of Terminations: 2; Length: 1.6mm; Series: ERJ; Technology: THICK FILM; Features: Automotive AEC-Q200; Case/Package: 0603; Power Rating: 100mW; Width: 0.031inch
U?#1 = CMP-019-00056-1: Converter DC to DC Step-Down 36V 220kHz to 2.2MHz 17-Pin FC2QFN

## Sheet HDMI.SchDoc
size C; SheetNumber: 6; SheetTotal: 9
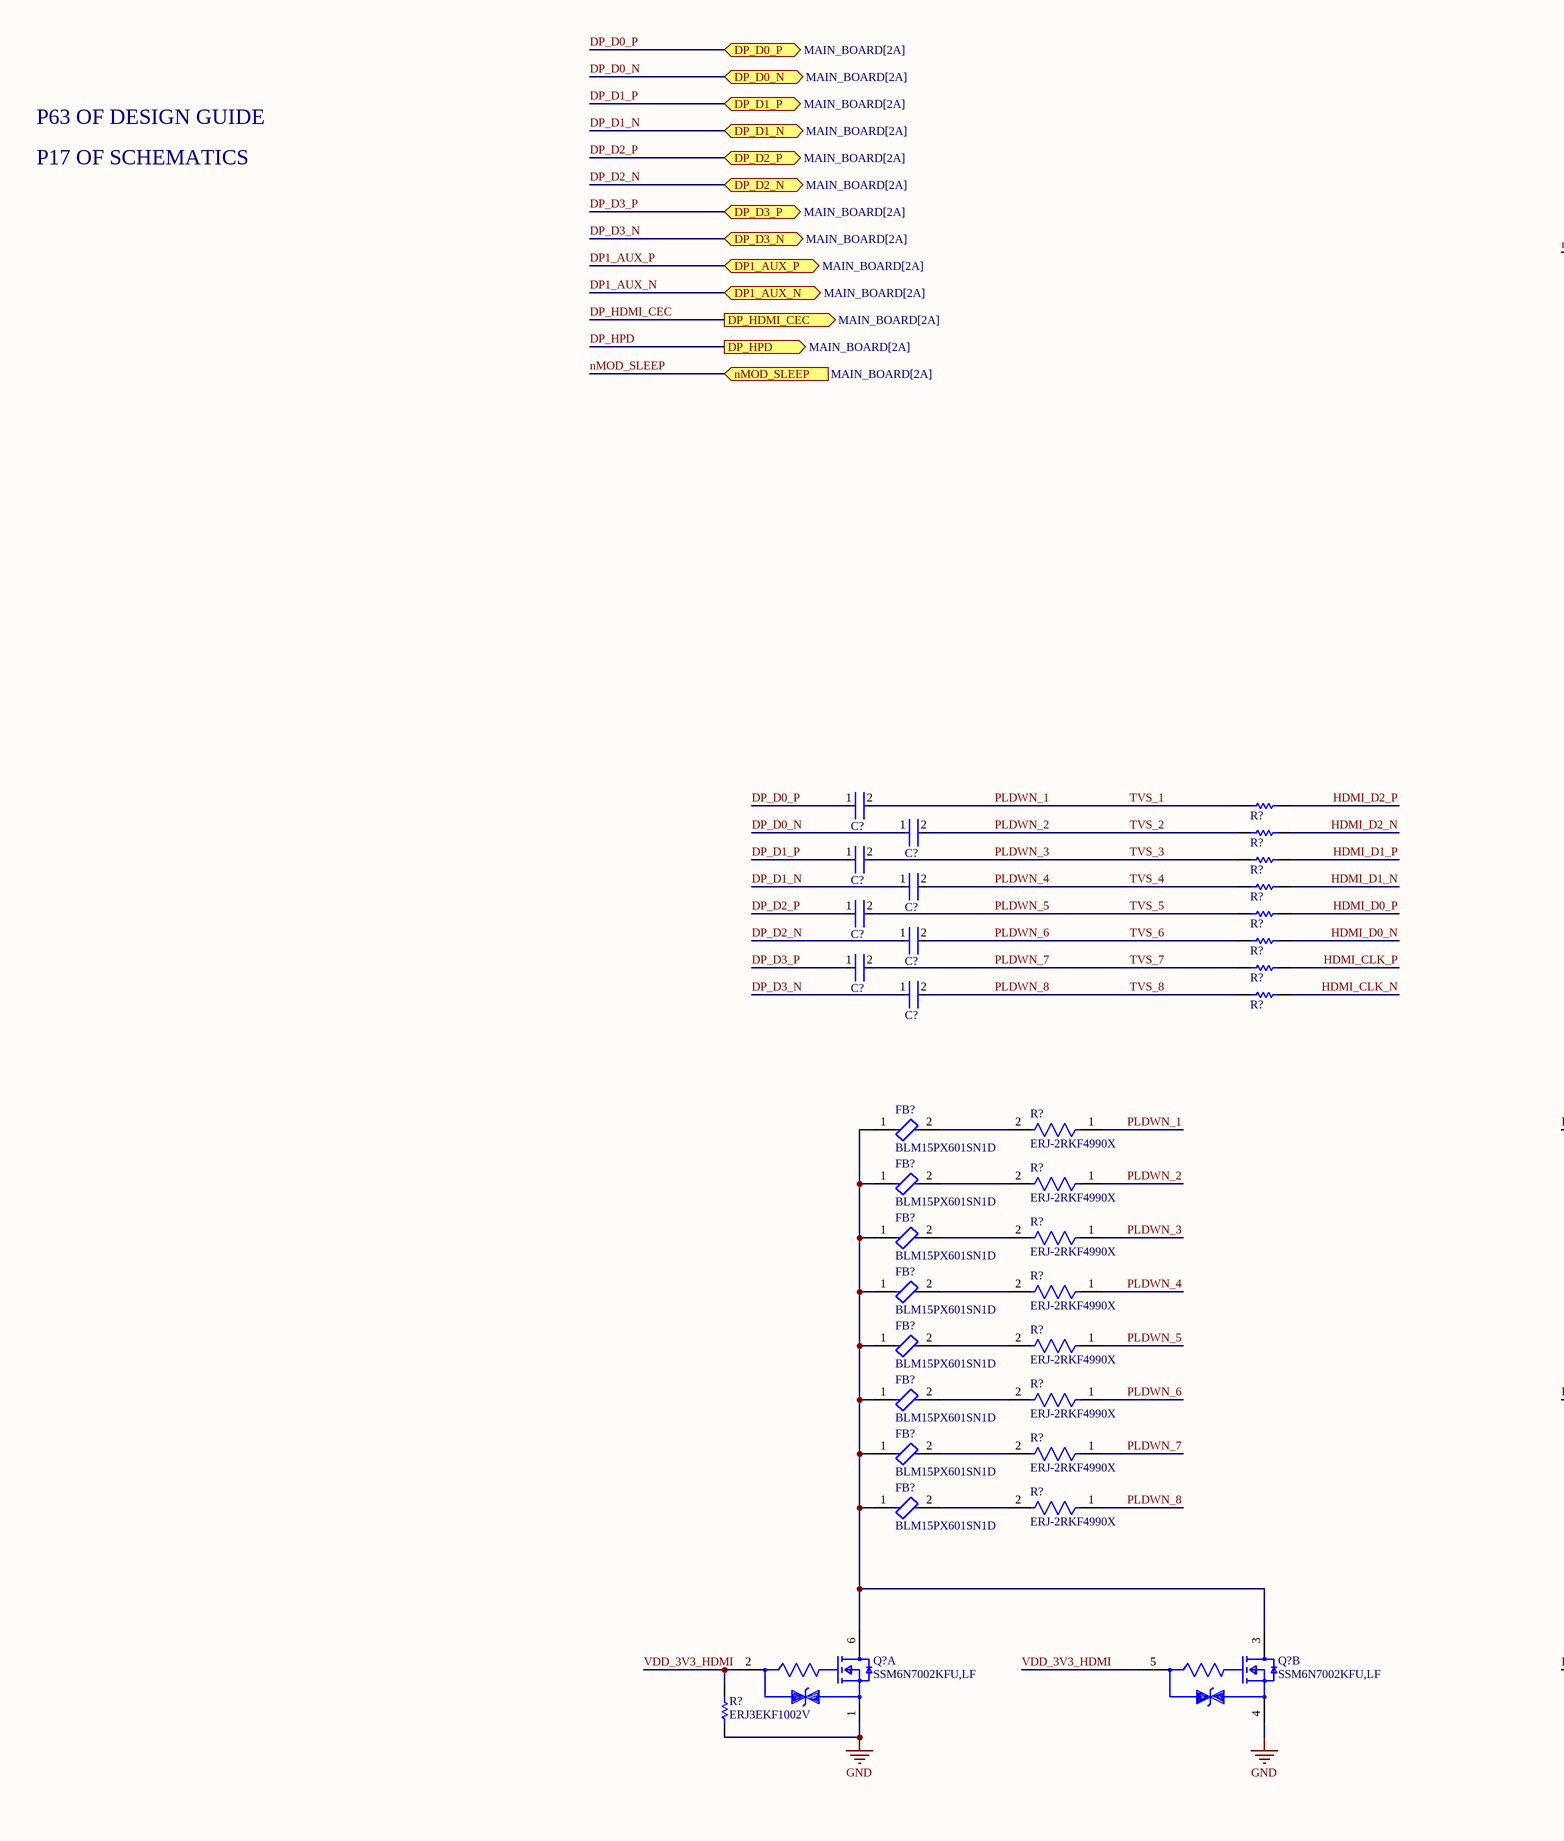
[diagram p10: HDMI.SchDoc, left]
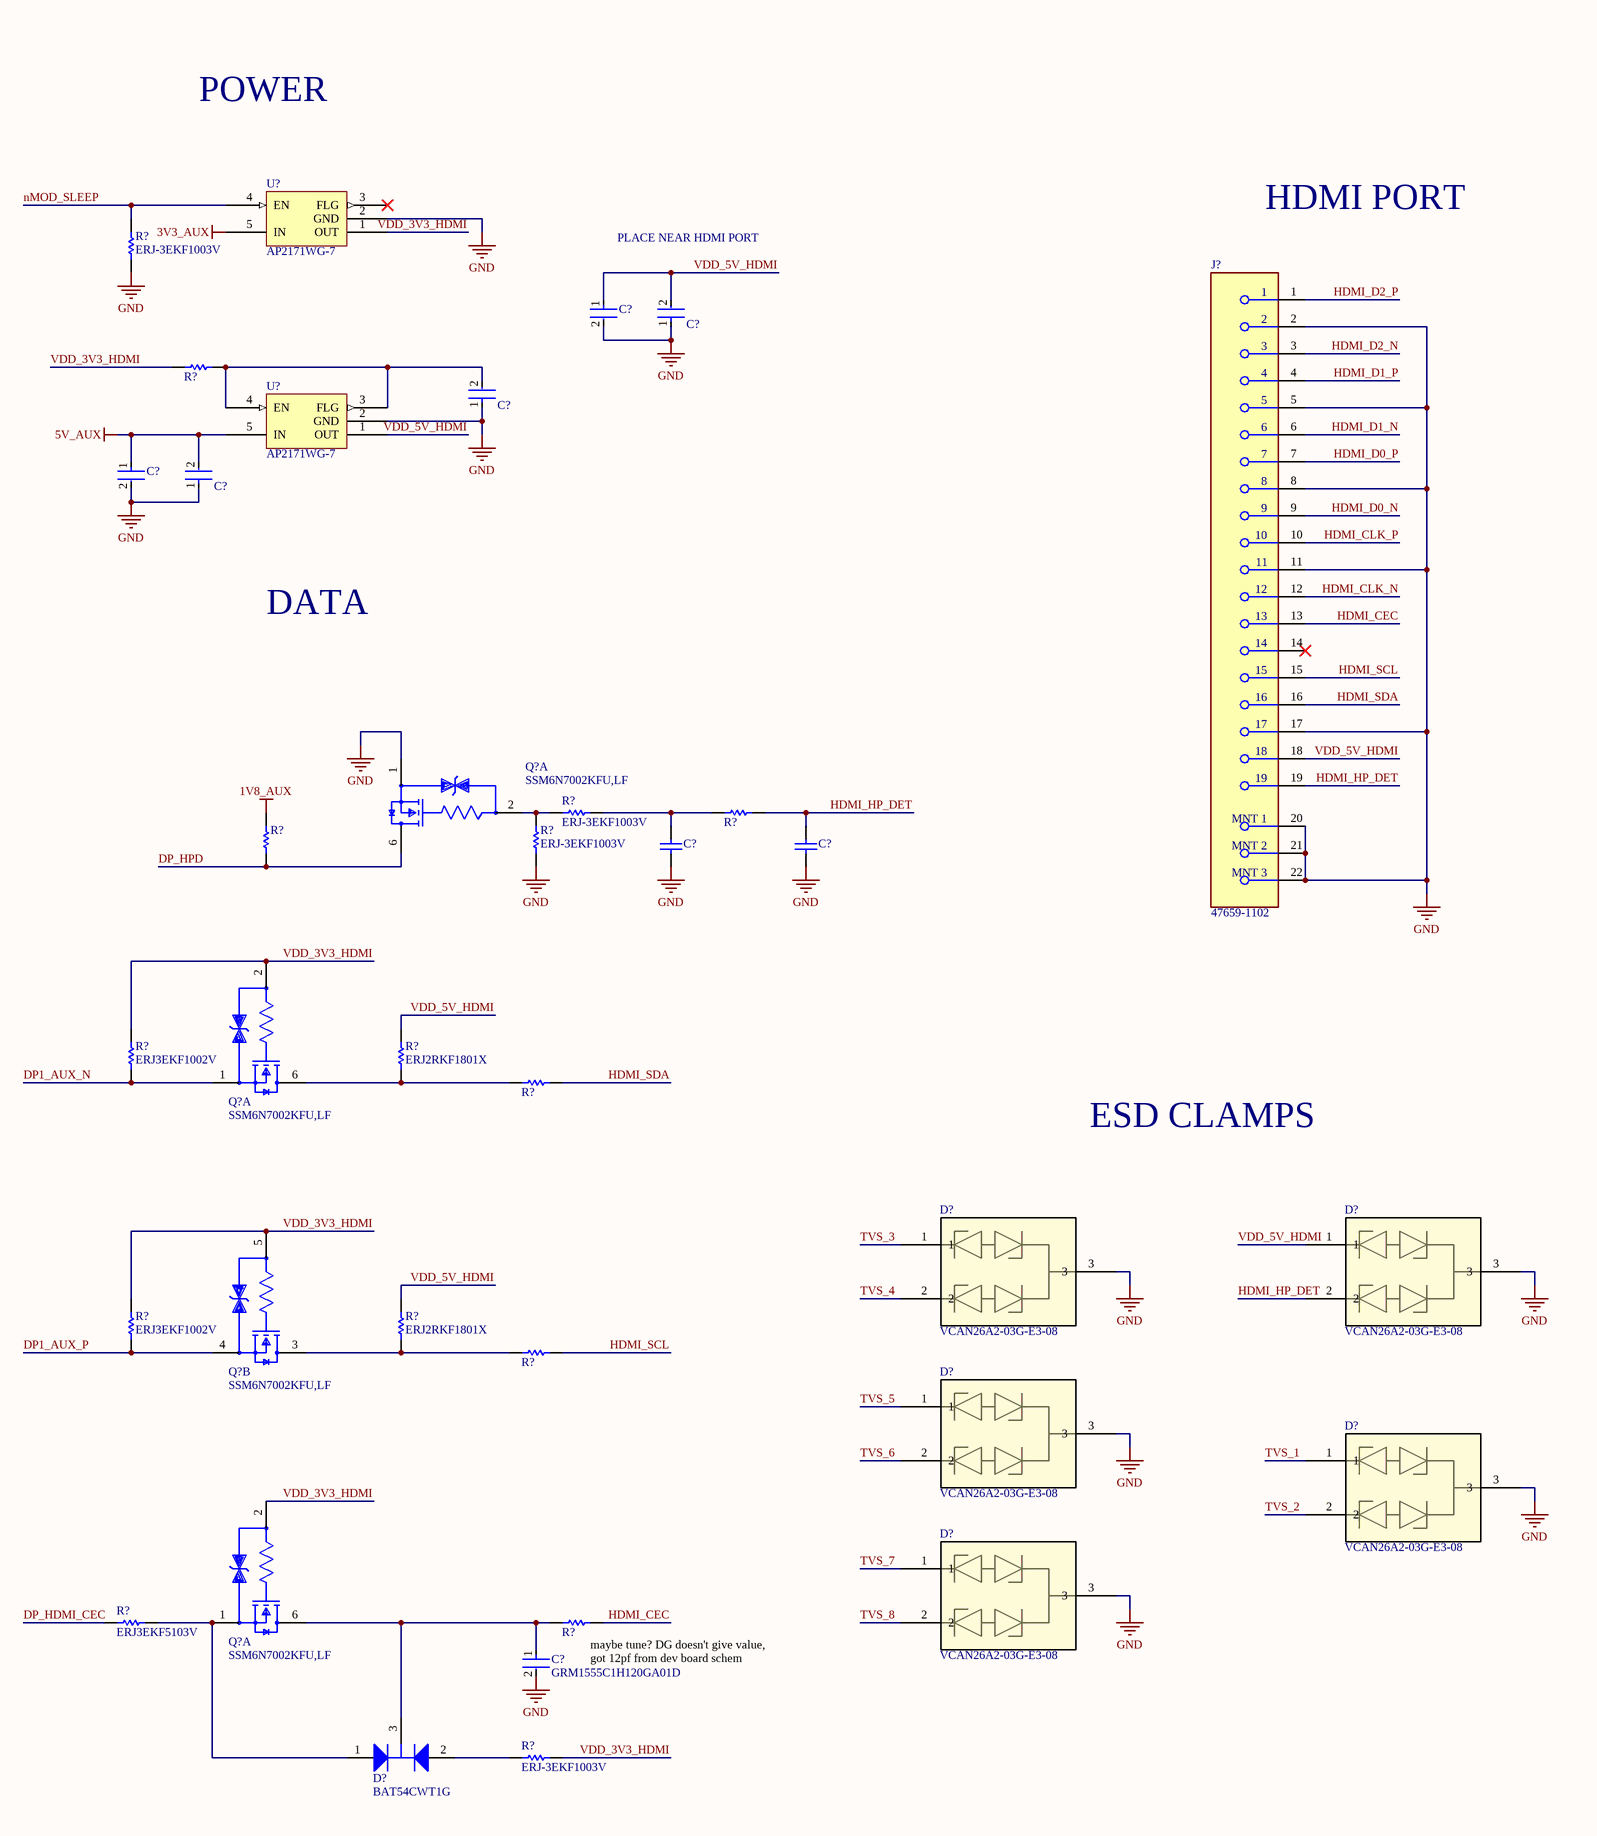
[diagram p11: HDMI.SchDoc, right]

### Parts
(Parts that share a designator on the sheet are numbered #1, #2 ... from top to bottom, then left to right.)
C?#11  GRM188R60J106ME47D  [FP-GRM188-0_1-e0_2_0_55-IPC_A]  (value not drawn)
C?#12  C1005X7R1H104K050BB  [FP-C1005-050-0_05-IPC_C]  (value not drawn)
C?#13  C1005X7R1H104K050BB  [FP-C1005-050-0_05-IPC_C]  (value not drawn)
C?#14  GRM188R60J106ME47D  [FP-GRM188-0_1-e0_2_0_55-IPC_A]  (value not drawn)
C?#15  C1005X7R1H104K050BB  [FP-C1005-050-0_05-IPC_C]  (value not drawn)
C?#16  C1005X7R1H104K050BB  [FP-C1005-050-0_05-IPC_C]  (value not drawn)
C?#17  C1005X7R1H104K050BB  [FP-C1005-050-0_05-IPC_C]  (value not drawn)
C?#18  C1005X7R1H104K050BB  [FP-C1005-050-0_05-IPC_C]  (value not drawn)
C?#19  C1005X7R1H104K050BB  [FP-C1005-050-0_05-IPC_C]  (value not drawn)
C?#20  C0402C221K5RAC7867  [CAPC1005X60X30NL05T10]  (value not drawn)
C?#21  C0402C221K5RAC7867  [CAPC1005X60X30NL05T10]  (value not drawn)
C?#22  C1005X7R1H104K050BB  [FP-C1005-050-0_05-IPC_C]  (value not drawn)
C?#23  C1005X7R1H104K050BB  [FP-C1005-050-0_05-IPC_C]  (value not drawn)
C?#24  C1005X7R1H104K050BB  [FP-C1005-050-0_05-IPC_C]  (value not drawn)
C?#25  C1005X7R1H104K050BB  [FP-C1005-050-0_05-IPC_C]  (value not drawn)
C?#26  GRM1555C1H120GA01D  [FP-GRM155-0_05-MFG]
D?#1  VCAN26A2-03G-E3-08  [VCAN26A2-03G-E3-08-Footprint-1]
D?#2  VCAN26A2-03G-E3-08  [VCAN26A2-03G-E3-08-Footprint-1]
D?#3  VCAN26A2-03G-E3-08  [VCAN26A2-03G-E3-08-Footprint-1]
D?#4  VCAN26A2-03G-E3-08  [VCAN26A2-03G-E3-08-Footprint-1]
D?#5  VCAN26A2-03G-E3-08  [VCAN26A2-03G-E3-08-Footprint-1]
D?#6  BAT54CWT1G  [ONSC-SOT-323-3-419-04_V]
FB?#1  BLM15PX601SN1D  [FP-BLM15-0_05-MFG]
FB?#2  BLM15PX601SN1D  [FP-BLM15-0_05-MFG]
FB?#3  BLM15PX601SN1D  [FP-BLM15-0_05-MFG]
FB?#4  BLM15PX601SN1D  [FP-BLM15-0_05-MFG]
FB?#5  BLM15PX601SN1D  [FP-BLM15-0_05-MFG]
FB?#6  BLM15PX601SN1D  [FP-BLM15-0_05-MFG]
FB?#7  BLM15PX601SN1D  [FP-BLM15-0_05-MFG]
FB?#8  BLM15PX601SN1D  [FP-BLM15-0_05-MFG]
J?#10  47659-1102  [FP-47659-1102-MFG]
Q?#1  SSM6N7002KFU,LF  [FP-SSOP6-P-0_65A-MFG]  (part A of 2)
Q?#2  SSM6N7002KFU,LF  [FP-SSOP6-P-0_65A-MFG]  (part A of 2)
Q?#3  SSM6N7002KFU,LF  [FP-SSOP6-P-0_65A-MFG]  (part B of 2)
Q?#4  SSM6N7002KFU,LF  [FP-SSOP6-P-0_65A-MFG]  (part A of 2)
Q?#5  SSM6N7002KFU,LF  [FP-SSOP6-P-0_65A-MFG]  (part A of 2)
Q?#6  SSM6N7002KFU,LF  [FP-SSOP6-P-0_65A-MFG]  (part B of 2)
R?#7  ERJ-3EKF1003V  [RESC1608X55X30ML15T15]
R?#8  ERJ3EKF1002V  [RESC1609X55X30LL15T15]  (value not drawn)
R?#9  0402 JUMPER 0 OHM  [RESC1005X40X25NL05T05]  (value not drawn)
R?#10  0402 JUMPER 0 OHM  [RESC1005X40X25NL05T05]  (value not drawn)
R?#11  0402 JUMPER 0 OHM  [RESC1005X40X25NL05T05]  (value not drawn)
R?#12  ERJ-3EKF1003V  [RESC1608X55X30ML15T15]
R?#13  0402 JUMPER 0 OHM  [RESC1005X40X25NL05T05]  (value not drawn)
R?#14  0402 JUMPER 0 OHM  [RESC1005X40X25NL05T05]  (value not drawn)
R?#15  0402 JUMPER 0 OHM  [RESC1005X40X25NL05T05]  (value not drawn)
R?#16  ERJ3EKF1002V  [RESC1609X55X30LL15T15]  (value not drawn)
R?#17  ERJ-3EKF1003V  [RESC1608X55X30ML15T15]
R?#18  0402 JUMPER 0 OHM  [RESC1005X40X25NL05T05]  (value not drawn)
R?#19  0402 JUMPER 0 OHM  [RESC1005X40X25NL05T05]  (value not drawn)
R?#20  0402 JUMPER 0 OHM  [RESC1005X40X25NL05T05]  (value not drawn)
R?#21  ERJ3EKF1002V  [RESC1609X55X30LL15T15]
R?#22  ERJ2RKF1801X  [RESC1005X40X25LL05T05]
R?#23  0402 JUMPER 0 OHM  [RESC1005X40X25NL05T05]  (value not drawn)
R?#24  ERJ-2RKF4990X  [FP-ERJ2RK-MFG]
R?#25  ERJ-2RKF4990X  [FP-ERJ2RK-MFG]
R?#26  ERJ-2RKF4990X  [FP-ERJ2RK-MFG]
R?#27  ERJ-2RKF4990X  [FP-ERJ2RK-MFG]
R?#28  ERJ-2RKF4990X  [FP-ERJ2RK-MFG]
R?#29  ERJ3EKF1002V  [RESC1609X55X30LL15T15]
R?#30  ERJ2RKF1801X  [RESC1005X40X25LL05T05]
R?#31  0402 JUMPER 0 OHM  [RESC1005X40X25NL05T05]  (value not drawn)
R?#32  ERJ-2RKF4990X  [FP-ERJ2RK-MFG]
R?#33  ERJ-2RKF4990X  [FP-ERJ2RK-MFG]
R?#34  ERJ-2RKF4990X  [FP-ERJ2RK-MFG]
R?#35  ERJ3EKF5103V  [RESC1608X55X30LL15T15]
R?#36  0402 JUMPER 0 OHM  [RESC1005X40X25NL05T05]  (value not drawn)
R?#37  ERJ3EKF1002V  [RESC1609X55X30LL15T15]
R?#38  ERJ-3EKF1003V  [RESC1608X55X30ML15T15]
U?#2  AP2171WG-7  [SOT95P285X130-5N]
U?#3  AP2171WG-7  [SOT95P285X130-5N]

### Ports
DP1_AUX_N (bidir, see MAIN_BOARD[2A]), DP1_AUX_P (bidir, see MAIN_BOARD[2A]), DP_D0_N (bidir, see MAIN_BOARD[2A]), DP_D0_P (bidir, see MAIN_BOARD[2A]), DP_D1_N (bidir, see MAIN_BOARD[2A]), DP_D1_P (bidir, see MAIN_BOARD[2A]), DP_D2_N (bidir, see MAIN_BOARD[2A]), DP_D2_P (bidir, see MAIN_BOARD[2A]), DP_D3_N (bidir, see MAIN_BOARD[2A]), DP_D3_P (bidir, see MAIN_BOARD[2A]), DP_HDMI_CEC (out, see MAIN_BOARD[2A]), DP_HPD (out, see MAIN_BOARD[2A]), nMOD_SLEEP (in, see MAIN_BOARD[2A])

### Nets
1V8_AUX: R?#16.2
3V3_AUX: U?#2.5(IN)
5V_AUX: C?#14.1 C?#15.2 U?#3.5(IN)
GND: C?#11.2 C?#12.1 C?#13.1 C?#14.2 C?#15.1 C?#20.1 C?#21.1 C?#26.2 D?#1.3 D?#2.3 D?#3.3 D?#4.3 D?#5.3 J?#10.2 J?#10.5 J?#10.8 J?#10.11 J?#10.17 J?#10.20(MNT_1) J?#10.21(MNT_2) J?#10.22(MNT_3) Q?#1.1(Source1) Q?#5.1(Source1) Q?#6.4(Source2) R?#7.1 R?#17.1 R?#37.1 U?#2.2(GND) U?#3.2(GND)
DP1_AUX_N: Q?#2.1(Source1) R?#21.1 ; port DP1_AUX_N
DP1_AUX_P: Q?#3.4(Source2) R?#29.1 ; port DP1_AUX_P
DP_D0_N: C?#17.1 ; port DP_D0_N
DP_D0_P: C?#16.1 ; port DP_D0_P
DP_D1_N: C?#19.1 ; port DP_D1_N
DP_D1_P: C?#18.1 ; port DP_D1_P
DP_D2_N: C?#23.1 ; port DP_D2_N
DP_D2_P: C?#22.1 ; port DP_D2_P
DP_D3_N: C?#25.1 ; port DP_D3_N
DP_D3_P: C?#24.1 ; port DP_D3_P
DP_HDMI_CEC: R?#35.1 ; port DP_HDMI_CEC
DP_HPD: Q?#1.6(Drain1) R?#16.1 ; port DP_HPD
HDMI_CEC: J?#10.13 R?#36.2
HDMI_CLK_N: J?#10.12 R?#20.2
HDMI_CLK_P: J?#10.10 R?#19.2
HDMI_D0_N: J?#10.9 R?#18.2
HDMI_D0_P: J?#10.7 R?#15.2
HDMI_D1_N: J?#10.6 R?#14.2
HDMI_D1_P: J?#10.4 R?#11.2
HDMI_D2_N: J?#10.3 R?#10.2
HDMI_D2_P: J?#10.1 R?#9.2
HDMI_HP_DET: C?#21.2 D?#2.2 J?#10.19 R?#13.2
HDMI_SCL: J?#10.15 R?#31.2
HDMI_SDA: J?#10.16 R?#23.2
nMOD_SLEEP: R?#7.2 U?#2.4(EN) ; port nMOD_SLEEP
PLDWN_1: C?#16.2 D?#4.1 R?#9.1 R?#24.1  [also labelled TVS_1]
PLDWN_2: C?#17.2 D?#4.2 R?#10.1 R?#25.1  [also labelled TVS_2]
PLDWN_3: C?#18.2 D?#1.1 R?#11.1 R?#26.1  [also labelled TVS_3]
PLDWN_4: C?#19.2 D?#1.2 R?#14.1 R?#27.1  [also labelled TVS_4]
PLDWN_5: C?#22.2 D?#3.1 R?#15.1 R?#28.1  [also labelled TVS_5]
PLDWN_6: C?#23.2 D?#3.2 R?#18.1 R?#32.1  [also labelled TVS_6]
PLDWN_7: C?#24.2 D?#5.1 R?#19.1 R?#33.1  [also labelled TVS_7]
PLDWN_8: C?#25.2 D?#5.2 R?#20.1 R?#34.1  [also labelled TVS_8]
VDD_3V3_HDMI: Q?#2.2(Gate1) Q?#3.5(Gate2) Q?#4.2(Gate1) Q?#5.2(Gate1) Q?#6.5(Gate2) R?#8.2 R?#21.2 R?#29.2 R?#37.2 R?#38.2 U?#2.1(OUT)
VDD_5V_HDMI: C?#11.1 C?#12.2 D?#2.1 J?#10.18 R?#22.2 R?#30.2 U?#3.1(OUT)
NetC?#13_2: C?#13.2 R?#8.1 U?#3.3(FLG) U?#3.4(EN)
NetC?#20_2: C?#20.2 R?#12.2 R?#13.1
NetC?#26_1: C?#26.1 D?#6.3(K) Q?#4.6(Drain1) R?#36.1
NetD?#6_1: D?#6.1(A1) Q?#4.1(Source1) R?#35.2
NetD?#6_2: D?#6.2(A2) R?#38.1
NetFB?#1_1: FB?#1.1 FB?#2.1 FB?#3.1 FB?#4.1 FB?#5.1 FB?#6.1 FB?#7.1 FB?#8.1 Q?#5.6(Drain1) Q?#6.3(Drain2)
NetFB?#1_2: FB?#1.2 R?#24.2
NetFB?#2_2: FB?#2.2 R?#25.2
NetFB?#3_2: FB?#3.2 R?#26.2
NetFB?#4_2: FB?#4.2 R?#27.2
NetFB?#5_2: FB?#5.2 R?#28.2
NetFB?#6_2: FB?#6.2 R?#32.2
NetFB?#7_2: FB?#7.2 R?#33.2
NetFB?#8_2: FB?#8.2 R?#34.2
NetQ?#1_2: Q?#1.2(Gate1) R?#12.1 R?#17.2
NetQ?#2_6: Q?#2.6(Drain1) R?#22.1 R?#23.1
NetQ?#3_3: Q?#3.3(Drain2) R?#30.1 R?#31.1

Not connected (* = marked no-connect by the designer): J?#10 14*; U?#2 3(FLG)*

### Notes on the sheet
- P63 OF DESIGN GUIDE
- P17 OF SCHEMATICS
- POWER
- HDMI PORT
- PLACE NEAR HDMI PORT
- DATA
- ESD CLAMPS
- (near R?#36) maybe tune? DG doesn't give value, got 12pf from dev board schem

### Library data of the parts
C?#11 C?#14 = CMP-2006-02792-2: Chip Multilayer Ceramic Capacitors for General Purpose, 0603, 10uF, X5R, 15%, 20%, 6.3V; Packaging: Tape and Reel; Voltage Rating (DC): 6.3V; Width: 0.031inch; Termination: SMD/SMT; Dielectric: X5R; Package Quantity: 4000; Voltage Rating: 6.3V; Capacitance: 10uF; Case/Package: 0603; Min Operating Temperature: -55°C; Voltage: 6.3V; Length: 1.6mm; Thickness: 0.035inch; Lead Free: Lead Free; Depth: 0.8mm; Case Code (Imperial): 0603; Max Operating Temperature: 85°C; Material: Ceramic; Height: 0.8mm; Tolerance: 20%; Mount: Surface Mount; REACH SVHC: No SVHC; Radiation Hardening: No; Case Code (Metric): 1608
C?#12 C?#13 C?#15-C?#19 C?#22-C?#25 = CMP-2000-05393-2: Multilayer Ceramic Capacitors 100nF ±10% 50V X7R SMD 0402; Voltage: 50V; Dielectric Material: Ceramic; Min Operating Temperature: -55°C; Depth: 0.5mm; Radiation Hardening: No; RoHS Compliant: Yes; Voltage Rating (DC): 50V; Lead Free: Lead Free; Resistor Type: Ceramic; Height: 0.5mm; Dielectric: X7R; Thickness: 0.022inch; Case/Package: 0402; Case Code (Metric): 1005; Termination: SMD/SMT; Capacitance: 100nF; Packaging: Tape and Reel; Max Operating Temperature: 125°C; Mount: Surface Mount; Package Quantity: 1; Width: 0.02inch; Weight: 2.3E-05oz; Voltage Rating: 50V; Tolerance: 10%; Construction: Flat; Case Code (Imperial): 0402; Length: 1mm; REACH SVHC: No SVHC; Series: C
C?#20 C?#21 = CMP-2008-03137-2: Manufacturer: Kemet; Part Number: C0402C221K5RAC7867
C?#26 = CMP-2008-03945-2: CAP CER 12PF 50V C0G/NP0 0402; Tolerance: 2%; Dielectric: C0G; Material: Ceramic; Termination: SMD/SMT; Mount: Surface Mount; REACH SVHC: No SVHC; Depth: 0.5mm; Case Code (Metric): 1005; Voltage Rating: 50V; Height: 0.5mm; Voltage Rating (DC): 50V; Case Code (Imperial): 0402; Package Quantity: 10000; Construction: Flat; Thickness: 0.022inch; Length: 1mm; Min Operating Temperature: -55°C; Width: 0.5mm; Lead Free: Lead Free; Capacitance: 12pF; Case/Package: 0402; Packaging: Tape and Reel; Series: GRM; Voltage: 50V; Radiation Hardening: No; Max Operating Temperature: 125°C
D?#1-D?#5 = CMP-004-00042-1: ESD Suppressor Diode TVS Bi-Dir 26.5V 3-Pin SOT-323 T/R
D?#6 = CMP-1055-00557-1: Dual Series Cathode Schottky Barrier Diodes, 3-Pin SOT-323, Pb-Free, Tape and Reel; Manufacturer: On Semiconductor; Configuration: Common Cathode; IFSM Max (A): 0.6; trr Max (ns): 5; ComponentLink2Description: Datasheet; Packing: Tape and Reel; ComponentLink3Description: Package Specification; Mounting Technology: Surface Mount; PartNumber: BAT54CWT1G; PackageVersion: Rev. N, 11/2008; RoHS: TRUE; ComponentLink3URL: http://www.onsemi.com/pub_link/Collateral/419-04.PDF; ComponentLink2URL: http://www.onsemi.cn/pub_link/Collateral/BAT54CWT1-D.PDF; PackageReference: SOT-323-3-419-04; ComponentLink1URL: http://www.onsemi.com/; ComponentLink1Description: Manufacturer URL; DatasheetVersion: Rev. 7; PackageDescription: 3-Pin Small Outline Transistor, Body 2 x 1.25 mm, Pitch 0.65 mm
FB?#1-FB?#8 = CMP-0686-00252-4: Chip Ferrite Bead, 0402, 600Ω @ 100MHz, 0.23Ω, 25%, 900mA; Number of Circuits: 1; Impedance: 600R; DC Resistance (DCR): 230mR; Material: Steel; Length: 1mm; Package Quantity: 10000; Height: 0.5mm; Width: 0.5mm; Max DC Current: 900mA; Number of Lines: 1; Termination: SMD/SMT; Packaging: Tape and Reel; Lead Free: Lead Free; Min Operating Temperature: -55°C; Max Operating Temperature: 125°C; Max Current Rating: 900mA; Case Code (Imperial): 0402; Number of Pins: 2; Current Rating: 900mA; Test Frequency: 100MHz; Case/Package: 0402; Tolerance: 25%; Case Code (Metric): 1005
J?#10 = CMP-04768-000010-1: HDMI REC.VERTICAL SMT TYPE W/HEI; RoHS Compliant: Yes
Q?#1-Q?#6 = CMP-35916-000009-1: MOSFET 2N-CH 60V 0.3A; Input Capacitance: 40pF; Continuous Drain Current (ID): 300mA; Max Power Dissipation: 285mW; FET Type: 2 N-Channel; Rds On Max: 1.5R; Mount: Surface Mount; Drain to Source Voltage (Vdss): 60V; Packaging: Tape and Reel
R?#7 R?#12 R?#17 R?#38 = CMP-2000-00182-1: Manufacturer: Panasonic; Part Number: ERJ-3EKF1003V
R?#8 R?#16 R?#21 R?#29 R?#37 = CMP-1012-00623-3: Chip Resistor, 10 KOhm, +/- 1%, 0.1 W, -55 to 155 degC, 0603 (1608 Metric), RoHS, Tape and Reel; Manufacturer: Panasonic; Voltage Rating: 75V; Case\/Package: 0603; Power Rating: 100mW; Resistance: 10KOhm; Temperature Coefficient: 100ppm\/degreesC; Number of Pins: 2; Package Reference: 603; Depth: 0.8mm; Mount: SurfaceMount; Package Description: 2-Pin Surface Mount Device, Body 1.6 x 0.85 mm; Datasheet Version: 02/2017; Length: 1.6mm; Lead Free: LeadFree; Height: 0.45mm; Number of Terminations: 2; Max Power Dissipation: 100mW; Min Operating Temperature: -55degC; Datasheet URL: https://industrial.panasonic.com/cdbs/www-data/pdf/RDA0000/AOA0000C304.pdf; Termination: SMD/SMT; Case Code (Metric): 1608; Case Code (Imperial): 0603; Tolerance: 1%; Max Operating Temperature: 155degC; RoHSCompliant: true; Voltage Rating (DC): 75V; Radiation Hardening: No; Packaging: TapeandReel; Composition: ThickFilm; Mounting Technology: SurfaceMount; Manufacturer URL: http://www.panasonic.com/; Width: 0.031inch; REACH SVHC: NoSVHC; Contact Plating: Tin; Military Standard: Not; Package Quantity: 1
R?#9-R?#11 R?#13-R?#15 R?#18-R?#20 R?#23 R?#31 R?#36 = CMP-009-00206-2: READ THE NAME
R?#22 R?#30 = CMP-2002-01128-1: Manufacturer: Panasonic; Part Number: ERJ2RKF1801X
R?#24-R?#28 R?#32-R?#34 = CMP-2002-00965-2: RES SMD 499 OHM 1% 1/10W 0402; Temperature Coefficient: 100ppm/°C; Max Power Dissipation: 100mW; Voltage Rating (DC): 50V; Resistance: 499R; Technology: THICK FILM; Min Operating Temperature: -55°C; Package Quantity: 1; Width: 0.02inch; Contact Plating: Tin; Tolerance: 1%; Features: Automotive AEC-Q200; Resistance Tolerance: 1%; Size Code: 0402; Military Standard: Not; Resistor Type: Thick Film; Case/Package: 0402; Mount: Surface Mount; Case Code (Metric): 1005; RoHS Compliant: Yes; REACH SVHC: No SVHC; Number of Terminations: 2; Construction: Rectangular; Packaging: Tape and Reel; Series: ERJ; Lead Free: Lead Free; Length: 1mm; Voltage Rating: 50V; Termination: SMD/SMT; Max Operating Temperature: 155°C; Case Code (Imperial): 0402; Height: 0.35mm; Power Rating: 100mW; Depth: 0.5mm
R?#35 = CMP-2000-00542-1: Manufacturer: Panasonic; Part Number: ERJ3EKF5103V
U?#2 U?#3 = CMP-019-00057-1: IC PWR SW USB 1CH 1A SOT-25-5